# Altium project DIOT_Kasli_Adapter.PrjPCB (part 3 of 4)

## Sheet Clock_Distribution.SchDoc: DIOT_Kasli_Adapter
size 420 x 297 mm; CheckedBy: -; DrawnBy: Marcin Kiepiela; Address1: Warsaw University of Technology; Address2: Nowowiejska 15/19 00-665 Warsaw; DocumentNumber: 2; SheetNumber: 2; SheetTotal: 8; EDA_Number: ARTIQ; Projet: ARTIQ/Sinara/DIOT; ModifiedBy: -; CheckedDate: -; Title2: -; DivGrp: ISE; Designer: Marcin Kiepiela; ModifiedDate: -; ProjectName: DIOT_Kasli_Adapter.PrjPCB
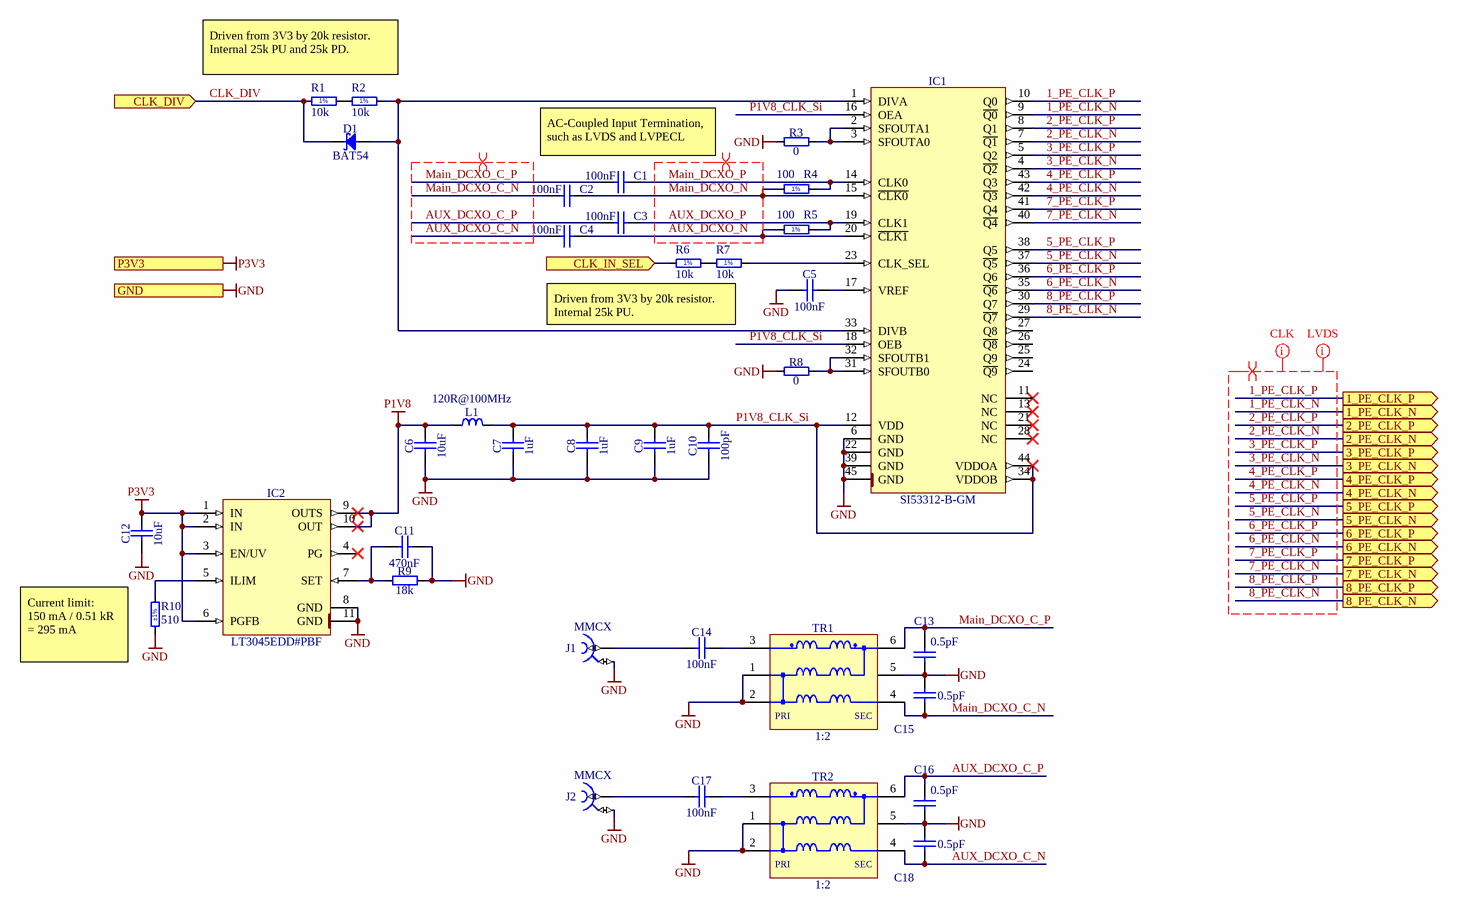
[diagram p4: Clock_Distribution.SchDoc]

### Parts
C1  100nF  [CAPC0603X33N]
C2  100nF  [CAPC0603X33N]
C3  100nF  [CAPC0603X33N]
C4  100nF  [CAPC0603X33N]
C5  100nF  [CAPC1005X55N]
C6  10uF  [CAPC1608X80N]
C7  1uF  [CAPC1608X87N]
C8  1uF  [CAPC1608X87N]
C9  1uF  [CAPC1608X87N]
C10  100pF  [CAPC1005X55N]
C11  470nF  [CAPC1005X55N]
C12  10uF  [CAPC1608X80N]
C13  0.5pF  [CAPC1005X50N]
C14  100nF  [CAPC1005X55N]
C15  0.5pF  [CAPC1005X50N]
C16  0.5pF  [CAPC1005X50N]
C17  100nF  [CAPC1005X55N]
C18  0.5pF  [CAPC1005X50N]
D1  BAT54  [SOT95P240X130-3N]
IC1  SI53312-B-GM  [QFN50P700X700X90-45N-S295]
IC2  LT3045EDD#PBF  [SON50P300X300X80-11N-R175X248]
J1  Family: MMCX  [HUBER-SUHNER_85_MMCX-50-0-1/111_OE]  (hidden comment: Coax_1Female_1Shield)
J2  Family: MMCX  [HUBER-SUHNER_85_MMCX-50-0-1/111_OE]  (hidden comment: Coax_1Female_1Shield)
L1  120R@100MHz  [INDC1608X95N]
R1  10k  [RESC1005X40N]
R2  10k  [RESC1005X40N]
R3  0  [RESC0603X28N]
R4  100  [RESC1005X40N]
R5  100  [RESC1005X40N]
R6  10k  [RESC1005X40N]
R7  10k  [RESC1005X40N]
R8  0  [RESC0603X28N]
R9  18k  [RESC1005X40N]
R10  510  Tolerance: ±1%  [RESC1005X40N]
TR1  1:2  [XFMR_MINI-CIRCUITS_DB1627]
TR2  1:2  [XFMR_MINI-CIRCUITS_DB1627]

### Ports
1_PE_CLK_N (out), 1_PE_CLK_P (out), 2_PE_CLK_N (out), 2_PE_CLK_P (out), 3_PE_CLK_N (out), 3_PE_CLK_P (out), 4_PE_CLK_N (out), 4_PE_CLK_P (out), 5_PE_CLK_N (out), 5_PE_CLK_P (out), 6_PE_CLK_N (out), 6_PE_CLK_P (out), 7_PE_CLK_N (out), 7_PE_CLK_P (out), 8_PE_CLK_N (out), 8_PE_CLK_P (out), CLK_DIV (in), CLK_IN_SEL (in), GND, P3V3 (in)

### Nets
GND: C5.1 C6.1 C7.1 C8.1 C9.1 C10.1 C11.2 C12.1 C13.1 C15.2 C16.1 C18.2 IC1.6(GND) IC1.22(GND) IC1.39(GND) IC1.45(GND) IC2.8(GND) IC2.11(GND) J1.2 J2.2 R3.1 R8.1 R9.2 R10.1 TR1.1(P1) TR1.2(P1) TR1.5(NC) TR2.1(P1) TR2.2(P1) TR2.5(NC) ; port GND
P1V8: C6.2 IC2.9(OUTS) IC2.10(OUT) L1.2
P3V3: C12.2 IC2.1(IN) IC2.2(IN) IC2.3(EN/UV) IC2.6(PGFB) ; port P3V3
1_PE_CLK_N: IC1.9(~{Q0}) ; port 1_PE_CLK_N
1_PE_CLK_P: IC1.10(Q0) ; port 1_PE_CLK_P
2_PE_CLK_N: IC1.7(~{Q1}) ; port 2_PE_CLK_N
2_PE_CLK_P: IC1.8(Q1) ; port 2_PE_CLK_P
3_PE_CLK_N: IC1.4(~{Q2}) ; port 3_PE_CLK_N
3_PE_CLK_P: IC1.5(Q2) ; port 3_PE_CLK_P
4_PE_CLK_N: IC1.42(~{Q3}) ; port 4_PE_CLK_N
4_PE_CLK_P: IC1.43(Q3) ; port 4_PE_CLK_P
5_PE_CLK_N: IC1.37(~{Q5}) ; port 5_PE_CLK_N
5_PE_CLK_P: IC1.38(Q5) ; port 5_PE_CLK_P
6_PE_CLK_N: IC1.35(~{Q6}) ; port 6_PE_CLK_N
6_PE_CLK_P: IC1.36(Q6) ; port 6_PE_CLK_P
7_PE_CLK_N: IC1.40(~{Q4}) ; port 7_PE_CLK_N
7_PE_CLK_P: IC1.41(Q4) ; port 7_PE_CLK_P
8_PE_CLK_N: IC1.29(~{Q7}) ; port 8_PE_CLK_N
8_PE_CLK_P: IC1.30(Q7) ; port 8_PE_CLK_P
AUX_DCXO_C_N: C4.1 C18.1 TR2.4(S1)  [project net AUX_DCXO_C_N_2]
AUX_DCXO_C_P: C3.1 C16.2 TR2.6(S1)  [project net AUX_DCXO_C_P_2]
AUX_DCXO_N: C4.2 IC1.20(~{CLK1}) R5.1  [project net AUX_DCXO_N_2]
AUX_DCXO_P: C3.2 IC1.19(CLK1) R5.2  [project net AUX_DCXO_P_2]
CLK_DIV: D1.3(C) R1.1 ; port CLK_DIV
CLK_IN_SEL: R6.1 ; port CLK_IN_SEL
Main_DCXO_C_N: C2.1 C15.1 TR1.4(S1)  [project net Main_DCXO_C_N_2]
Main_DCXO_C_P: C1.1 C13.2 TR1.6(S1)  [project net Main_DCXO_C_P_2]
Main_DCXO_N: C2.2 IC1.15(~{CLK0}) R4.1  [project net Main_DCXO_N_2]
Main_DCXO_P: C1.2 IC1.14(CLK0) R4.2  [project net Main_DCXO_P_2]
P1V8_CLK_Si: C7.2 C8.2 C9.2 C10.2 IC1.12(VDD) IC1.16(OEA) IC1.18(OEB) IC1.34(VDDOB) IC1.44(VDDOA) L1.1  [project net P1V8_CLK_Si_2]
NetC5_2: C5.2 IC1.17(VREF)
NetC11_1: C11.1 IC2.7(SET) R9.1
NetC14_1: C14.1 J1.1
NetC14_2: C14.2 TR1.3(P1)
NetC17_1: C17.1 J2.1
NetC17_2: C17.2 TR2.3(P1)
NetD1_1: D1.1(A) IC1.1(DIVA) IC1.33(DIVB) R2.2
NetIC1_2: IC1.2(SFOUTA1) IC1.3(SFOUTA0) R3.2
NetIC1_23: IC1.23(CLK_SEL) R7.2
NetIC1_31: IC1.31(SFOUTB0) IC1.32(SFOUTB1) R8.2
NetIC2_5: IC2.5(ILIM) R10.2
NetR1_2: R1.2 R2.1
NetR6_2: R6.2 R7.1

Not connected (* = marked no-connect by the designer): IC1 11(NC)* 13(NC)* 21(NC)* 24(~{Q9}) 25(Q9) 26(~{Q8}) 27(Q8) 28(NC)*; IC2 4(PG)*

### Layout directives
net class LVDS: 1_PE_CLK_N, 1_PE_CLK_P, 2_PE_CLK_N, 2_PE_CLK_P, 3_PE_CLK_N, 3_PE_CLK_P, 4_PE_CLK_N, 4_PE_CLK_P, 5_PE_CLK_N, 5_PE_CLK_P, 6_PE_CLK_N, 6_PE_CLK_P, 7_PE_CLK_N, 7_PE_CLK_P, 8_PE_CLK_N, 8_PE_CLK_P
net class CLK: 1_PE_CLK_N, 1_PE_CLK_P, 2_PE_CLK_N, 2_PE_CLK_P, 3_PE_CLK_N, 3_PE_CLK_P, 4_PE_CLK_N, 4_PE_CLK_P, 5_PE_CLK_N, 5_PE_CLK_P, 6_PE_CLK_N, 6_PE_CLK_P, 7_PE_CLK_N, 7_PE_CLK_P, 8_PE_CLK_N, 8_PE_CLK_P
differential pair: 1_PE_CLK_N, 1_PE_CLK_P, 2_PE_CLK_N, 2_PE_CLK_P, 3_PE_CLK_N, 3_PE_CLK_P, 4_PE_CLK_N, 4_PE_CLK_P, 5_PE_CLK_N, 5_PE_CLK_P, 6_PE_CLK_N, 6_PE_CLK_P, 7_PE_CLK_N, 7_PE_CLK_P, 8_PE_CLK_N, 8_PE_CLK_P, AUX_DCXO_C_N, AUX_DCXO_C_P, AUX_DCXO_N, AUX_DCXO_P, Main_DCXO_C_N, Main_DCXO_C_P, Main_DCXO_N, Main_DCXO_P

### Notes on the sheet
- Driven from 3V3 by 20k resistor.
  Internal 25k PU and 25k PD.
- AC-Coupled Input Termination, such as LVDS and LVPECL
- Driven from 3V3 by 20k resistor. Internal 25k PU.
- (near R10) Current limit:
  150 mA / 0.51 kR
  = 295 mA
- Project/Equipment
- Document
- Designer
- Drawn by
- Check.by
- Copyright WUT 2023.
  This document describes Open Hardware and is licensed under the CERN-OHL-W v2
  You may redistribute and modify this documentation and make products using it under the terms of the CERN-OHL-W v2 (https:/cern.ch/cern-ohl). This documentation is distributed WITHOUT ANY EXPRESS OR IMPLIED WARRANTY, INCLUDING OF MERCHANTABILITY, SATISFACTORY QUALITY AND FITNESS FOR A PARTICULAR PURPOSE. Please see the CERN-OHL-W v2 for applicable conditions.
  Source location: https://github.com/sinara-hw/EEM_FMC_Carrier
  As per CERN-OHL-W v2 section 4, should You produce hardware based on these sources, You must maintain the Source Location visible on the silkscreen or top copper for a EEM FMC Carrier PCB or other product you make using this documentation.
- Contact:
- File
- Last Mod.
- Print Date
- Sheet
- Size
- A3
- of
- Rev
- (in symbol R0402_10K_1%_0.0625W_100PPM) 1%
- (in symbol R0402_100R_1%_0.0625W_100PPM) 1%
- (in symbol XFMR_MINI-CIRCUITS_TCM2-43X+) PRI; SEC

### Library data of the parts
C1-C4 = CC0201_100NF_6.3V_10%_X5R: Non-polarised capacitor; Part Description: SMD Multilayer Chip Ceramic Capacitor; Manufacturer: GENERIC; Manufacturer1 Part Number: 02016D104KAT2A; Voltage: 6.3V; TC: X5R; Tolerance: ±10%; Part Number: CC0201_100NF_6.3V_10%_X5R; Component Kind: Standard; Component Type: Standard; Pin Count: 2; Value: 100nF; Status: Not Recommended; Manufacturer Part Number: CC0201_100NF_6.3V_10%_X5R; Case: 0201; Mounted: Yes; Socket: No; SMD: Yes; Sense: No; Manufacturer1 Example: AVX; Manufacturer1 ComponentHeight: 0.33mm; HelpURL: \\cern.ch\dfs\Applications\Altium\Datasheets\CC0201_X5R_AVX.pdf; Author: CERN DEM JLC; CreateDate: 03.12.2007; LatestRevisionDate: 03.12.2007
C5 C14 C17 = CC0402_100NF_16V_10%_X7R: Non-polarised capacitor; Part Description: SMD Multilayer Chip Ceramic Capacitor; Manufacturer: GENERIC; Manufacturer1 Part Number: GRM155R71C104KA88D; Voltage: 16V; TC: X7R; Tolerance: ±10%; Part Number: CC0402_100NF_16V_10%_X7R; Component Kind: Standard; Component Type: Standard; Pin Count: 2; Value: 100nF; Status: Not Recommended; Manufacturer Part Number: CC0402_100NF_16V_10%_X7R; Case: 0402; Mounted: Yes; Socket: No; SMD: Yes; Sense: No; Manufacturer1 Example: MURATA; Manufacturer1 ComponentHeight: 0.55mm; HelpURL: \\cern.ch\dfs\Applications\Altium\Datasheets\CC0402_X7R_MURATA_GRM.pdf; Author: CERN DEM JLC; CreateDate: 05.12.2013; LatestRevisionDate: 03.12.2007
C6 C12 = CC0603_10UF_10V_10%_X5R: Non-polarised capacitor; Part Description: SMD Multilayer Chip Ceramic Capacitor; Manufacturer: GENERIC; Manufacturer1 Part Number: GRM188R61A106KE69D; Voltage: 10V; TC: X5R; Tolerance: ±10%; Part Number: CC0603_10UF_10V_10%_X5R; Component Kind: Standard; Component Type: Standard; Pin Count: 2; Value: 10uF; Status: None; Manufacturer Part Number: CC0603_10UF_10V_10%_X5R; Case: 0603; Mounted: Yes; Socket: No; SMD: Yes; Sense: No; Manufacturer1 Example: MURATA; Manufacturer1 ComponentHeight: 0.8mm; HelpURL: \\cern.ch\dfs\Applications\Altium\Datasheets\CC0603_MURATA_GRM188R61A106KE69D.pdf; Author: CERN DEM JLC; CreateDate: 31.01.2017; LatestRevisionDate: 31.01.2017
C7-C9 = CC0603_1UF_25V_10%_X7R: Non-polarised capacitor; Part Description: SMD Multilayer Chip Ceramic Capacitor; Manufacturer: GENERIC; Manufacturer1 Part Number: GRM188R71E105KA12D; Voltage: 25V; TC: X7R; Tolerance: ±10%; Part Number: CC0603_1UF_25V_10%_X7R; Component Kind: Standard; Component Type: Standard; Pin Count: 2; Value: 1uF; Status: None; Manufacturer Part Number: CC0603_1UF_25V_10%_X7R; Case: 0603; Mounted: Yes; Socket: No; SMD: Yes; Sense: No; Manufacturer1 Example: MURATA; Manufacturer1 ComponentHeight: 0.9mm; HelpURL: \\cern.ch\dfs\Applications\Altium\Datasheets\CC0603_X7R_MURATA.pdf; Author: CERN DEM JLC; CreateDate: 18.01.2011; LatestRevisionDate: 18.01.2011
C10 = CC0402_100PF_50V_5%_C0G: Non-polarised capacitor; Part Description: SMD Multilayer Chip Ceramic Capacitor; Manufacturer: GENERIC; Manufacturer1 Part Number: C0402C101J5GACTU; Voltage: 50V; TC: C0G/NP0; Tolerance: ±5%; Part Number: CC0402_100PF_50V_5%_C0G; Component Kind: Standard; Component Type: Standard; Pin Count: 2; Value: 100pF; Status: Preferred; Manufacturer Part Number: CC0402_100PF_50V_5%_C0G; Case: 0402; Mounted: Yes; Socket: No; SMD: Yes; Sense: No; Manufacturer1 Example: KEMET; Manufacturer1 ComponentHeight: 0.55mm; HelpURL: \\cern.ch\dfs\Applications\Altium\Datasheets\CC0805_C0G_KEMET_(Commercial Grade).pdf; Author: CERN DEM JLC; CreateDate: 03.12.2007; LatestRevisionDate: 22.04.2015
C11 = CC0402_470NF_16V_10%_X5R: Non-polarised capacitor; Part Description: SMD Multilayer Chip Ceramic Capacitor; Manufacturer: GENERIC; Manufacturer1 Part Number: C1005X5R1C105KT; Voltage: 16V; TC: X5R; Tolerance: ±10%; Part Number: CC0402_470NF_16V_10%_X5R; Component Kind: Standard; Component Type: Standard; Pin Count: 2; Value: 470nF; Status: Preferred; Manufacturer Part Number: CC0402_470NF_16V_10%_X5R; Case: 0402; Mounted: Yes; Socket: No; SMD: Yes; Sense: No; Manufacturer1 Example: TDK; Manufacturer1 ComponentHeight: 0.55mm; HelpURL: \\cern.ch\dfs\Applications\Altium\Datasheets\CC0402_X5R_TDK_C.pdf; Author: CERN DEM JLC; CreateDate: 25.10.2012; LatestRevisionDate: 25.10.2012
C13 C15 C16 C18 = CC0402_0.5PF_25V_0.05PF_AVX_04023J0R5ABSTR: Non-polarised capacitor; Part Description: Thin-Film Chip Capacitors for RF Signal and Power Applications, Accu-P Series; Manufacturer: AVX; Voltage: 25V; Tolerance: ±0.05pF; Part Number: CC0402_0.5PF_25V_0.05PF_AVX_04023J0R5ABSTR; Component Kind: Standard; Component Type: Standard; Pin Count: 2; Value: 0.5pF; Status: None; Manufacturer Part Number: 04023J0R5ABSTR; Case: 0402; Mounted: Yes; Socket: No; SMD: Yes; Sense: No; ComponentHeight: 0.5mm; HelpURL: \\cern.ch\dfs\Applications\Altium\Datasheets\CC0402_AVX_ACCU-P.pdf; Author: CERN DEM JLC; CreateDate: 2017-02-22; LatestRevisionDate: 2017-02-22
D1 = BAT54: Diode Schottky  Anode Pin 1 Cathode Pin 3 (Pas de pin 2); Part Description: Single Small Signal Schottky Diode; Manufacturer: FAIRCHILD SEMICONDUCTOR; Voltage: 30V; Power: 200mA; PressFit: No; Bonding: No; Part Number: BAT54; Component Kind: Standard; Component Type: Standard; Device: BAT54; PackageDescription: SOT, 0.95mm Pitch; 3 Pin, 1.30mm W X 2.90mm L X 1.30mm H body, IPC Medium Density; Manufacturer Part Number: BAT54; Pin Count: 3; Case: SOT23-3; Mounted: Yes; Socket: No; SMD: Yes; Sense: No; ComponentHeight: 1.30mm; HelpURL: \\cern.ch\dfs\Applications\Altium\Datasheets\BAT54.pdf; Author: CERN DEM JLC; CreateDate: 17.09.2009; LatestRevisionDate: 27.05.2010
IC1 = SI53312-B-GM: 2 Input/10 Output, Low Jitter Universal Buffer/Level Translator With 2:1 Input Mux (<1.25 GHZ); Manufacturer: SILICON LABS; PressFit: No; Bonding: No; Part Number: SI53312-B-GM; Component Kind: Standard; Component Type: Standard; Device: SI53312-B-GM; PackageDescription: QFN, 0.50mm Pitch, Square; 44 Pin, 7.00mm L X 7.00mm W X 0.90mm H body (w/Thermal Tab 2.95 X 2.95mm), IPC Medium Density; Part Description: 2 Input/10 Output, Low Jitter Universal Buffer/Level Translator With 2:1 Input Mux (<1.25 GHZ); Manufacturer Part Number: SI53312-B-GM; Pin Count: 45; Case: QFN44; Mounted: Yes; Socket: No; SMD: Yes; Sense: No; ComponentHeight: 0.9mm; Author: CERN DEM MR; HelpURL: \\cern.ch\dfs\Applications\Altium\Datasheets\SI53312-B-GM.pdf; CreateDate: 02.10.2017; LatestRevisionDate: 02.10.2017
IC2 = LT3045EDD#PBF: 20V, 500mA, Ultralow Noise, Ultrahigh PSRR Linear Regulator; Manufacturer: LINEAR TECHNOLOGY; PressFit: No; Bonding: No; Part Number: LT3045EDD#PBF; Component Kind: Standard; Component Type: Standard; Device: LT3045EDD#PBF; PackageDescription: SON, 0.50mm Pitch; 10-pin, 3.00mm W  X 3.00mm L X 0.80mm H Body, (w/thermal tab 1.75 X 2.48 mm), IPC Medium Density; Part Description: 20V, 500mA, Ultralow Noise, Ultrahigh PSRR Linear Regulator; Manufacturer Part Number: LT3045EDD#PBF; Pin Count: 11; Case: SON10; Mounted: Yes; Socket: No; SMD: Yes; Sense: No; ComponentHeight: 0.8mm; HelpURL: \\cern.ch\dfs\Applications\Altium\Datasheets\LT3045EDD#PBF.pdf; Author: CERN DEM JLC; CreateDate: 07.12.2016; LatestRevisionDate: 07.12.2016
J1 J2 = HUBER-SUHNER_85_MMCX-50-0-1/111_OE: Part Description: MMCX 50 Ohms Right Angle PCB Jack; Manufacturer: HUBER+SUHNER; PressFit: No; Part Number: HUBER-SUHNER_85_MMCX-50-0-1/111_OE; Component Kind: Standard; Component Type: Standard; Pin Count: 2; Mounted: Yes; Socket: No; SMD: No; Sense: No; Status: None; Manufacturer Part Number: 85_MMCX-50-0-1/111_OE; ComponentHeight: 9.6mm; HelpURL: \\cern.ch\dfs\Applications\Altium\Datasheets\HUBER-SUHNER_85_MMCX-50-0-1-111_OE.pdf; Author: CERN DEM JLC; CreateDate: 06.11.2014; LatestRevisionDate: 06.11.2014
L1 = IND0603_MURATA_BLM18PG121SN1D: Inductor; Part Description: SMD EMIFIL Chip Ferrite Bead; Manufacturer: MURATA; Power: 2A; Resistance: 0.05R; Part Number: IND0603_MURATA_BLM18PG121SN1D; Component Kind: Standard; Component Type: Standard; Pin Count: 2; Value: 120R@100MHz; Status: None; Manufacturer Part Number: BLM18PG121SN1D; Case: 0603; Mounted: Yes; Socket: No; SMD: Yes; Sense: No; ComponentHeight: 0.95mm; HelpURL: \\cern.ch\dfs\Applications\Altium\Datasheets\IND0603_MURATA_BLM18P.pdf; Author: CERN DEM BC; CreateDate: 2015-07-27; LatestRevisionDate: 2015-07-27
R1 R2 R6 R7 = R0402_10K_1%_0.0625W_100PPM: Resistor - 1%; Part Description: General Purpose Thick Film Chip Resistor; Manufacturer: GENERIC; Manufacturer1 Part Number: 232270671003L; TC: ±100ppm/°C; Part Number: R0402_10K_1%_0.0625W_100PPM; Component Kind: Standard; Component Type: Standard; Pin Count: 2; Value: 10k; Status: Not recommended; Power: 0.0625W; Tolerance: ±1%; Manufacturer Part Number: R0402_10K_1%_0.0625W_100PPM; Case: 0402; Mounted: Yes; Sense: No; Socket: No; SMD: Yes; Manufacturer1 Example: YAGEO PHYCOMP; Manufacturer1 ComponentHeight: 0.4mm; HelpURL: \\cern.ch\dfs\Applications\Altium\Datasheets\R0402_Phycomp_RC0402.pdf; Author: CERN DEM JLC; CreateDate: 03.12.2007; LatestRevisionDate: 17.10.2012
R3 R8 = R0201_0R_JUMPER: Resistor; Part Description: 1A (0.05R Max DC Resistance) Zero Ohm Jumper; Manufacturer: GENERIC; Manufacturer1 Part Number: CRCW02010000Z0ED; PressFit: No; Part Number: R0201_0R_JUMPER; Component Kind: Standard; Component Type: Standard; Pin Count: 2; Value: 0; Status: Not Recommended; Manufacturer Part Number: R0201_0R_JUMPER; Case: 0201; Mounted: Yes; Sense: No; Socket: No; SMD: Yes; Manufacturer1 Example: VISHAY; Manufacturer1 ComponentHeight: 0.27mm; HelpURL: \\cern.ch\dfs\Applications\Altium\Datasheets\R0201_VISHAY_CRCW e3.pdf; Author: CERN DEM JLC; CreateDate: 19.11.2014; LatestRevisionDate: 08.01.2015
R4 R5 = R0402_100R_1%_0.0625W_100PPM: Resistor - 1%; Part Description: General Purpose Thick Film Chip Resistor; Manufacturer: GENERIC; Manufacturer1 Part Number: 232270671001L; TC: ±100ppm/°C; PressFit: No; Part Number: R0402_100R_1%_0.0625W_100PPM; Component Kind: Standard; Component Type: Standard; Pin Count: 2; Value: 100; Status: Not Recommended; Power: 0.0625W; Tolerance: ±1%; Manufacturer Part Number: R0402_100R_1%_0.0625W_100PPM; Case: 0402; Mounted: Yes; Sense: No; Socket: No; SMD: Yes; Manufacturer1 Example: YAGEO PHYCOMP; Manufacturer1 ComponentHeight: 0.4mm; HelpURL: \\cern.ch\dfs\Applications\Altium\Datasheets\R0402_Phycomp_RC0402.pdf; Author: CERN DEM JLC; CreateDate: 03.12.2007; LatestRevisionDate: 17.10.2012
R9 = R0402_18K_1%_0.0625W_100PPM: Resistor - 1%; Part Description: General Purpose Thick Film Chip Resistor; Manufacturer: GENERIC; Manufacturer1 Part Number: 232270671803L; TC: ±100ppm/°C; PressFit: No; Part Number: R0402_18K_1%_0.0625W_100PPM; Component Kind: Standard; Component Type: Standard; Pin Count: 2; Value: 18k; Status: Not Recommended; Power: 0.0625W; Tolerance: ±1%; Manufacturer Part Number: R0402_18K_1%_0.0625W_100PPM; Case: 0402; Mounted: Yes; Sense: No; Socket: No; SMD: Yes; Manufacturer1 Example: YAGEO PHYCOMP; Manufacturer1 ComponentHeight: 0.4mm; HelpURL: \\cern.ch\dfs\Applications\Altium\Datasheets\R0402_Phycomp_RC0402.pdf; Author: CERN DEM JLC; CreateDate: 03.12.2007; LatestRevisionDate: 17.10.2012
R10 = R0402_510R_1%_0.0625W_100PPM: Resistor - 1%; Part Description: General Purpose Thick Film Chip Resistor; Manufacturer: GENERIC; Manufacturer1 Part Number: 232270675101L; TC: ±100ppm/°C; PressFit: No; Part Number: R0402_510R_1%_0.0625W_100PPM; Component Kind: Standard; Component Type: Standard; Pin Count: 2; Value: 510; Status: Not Recommended; Power: 0.0625W; Manufacturer Part Number: R0402_510R_1%_0.0625W_100PPM; Case: 0402; Mounted: Yes; Sense: No; Socket: No; SMD: Yes; Manufacturer1 Example: YAGEO PHYCOMP; Manufacturer1 ComponentHeight: 0.4mm; HelpURL: \\cern.ch\dfs\Applications\Altium\Datasheets\R0402_Phycomp_RC0402.pdf; Author: CERN DEM JLC; CreateDate: 03.12.2007; LatestRevisionDate: 17.10.2012
TR1 TR2 = XFMR_MINI-CIRCUITS_TCM2-43X+: 50 OHMS 10 to 4000 MHz RF Transformer; Power: 0.4W; Part Number: XFMR_MINI-CIRCUITS_TCM2-43X+; Component Kind: Standard; Component Type: Standard; Pin Count: 6; Value: 1:2; Status: None; Part Description: 50 Ohms 10 to 4000MHz RF Transformer; Manufacturer: MINI-CIRCUITS; Manufacturer Part Number: TCM2-43X+; Mounted: Yes; Socket: No; Sense: No; SMD: Yes; ComponentHeight: 4.06mm; HelpURL: \\cern.ch\dfs\Applications\Altium\Datasheets\XFMR_MINI-CIRCUITS_TCM2-43X+.pdf; Author: CERN DEM BC; CreateDate: 2016-02-12; LatestRevisionDate: 2016-02-12

## Sheet IDC_EXT_CPCIS_interconn_map.SchDoc: DIOT_Kasli_Adapter
size 420 x 297 mm; CheckedBy: -; DrawnBy: Marcin Kiepiela; Address1: Warsaw University of Technology; Address2: Nowowiejska 15/19 00-665 Warsaw; DocumentNumber: 6; SheetNumber: 6; SheetTotal: 8; EDA_Number: ARTIQ; Projet: ARTIQ/Sinara/DIOT; ModifiedBy: -; CheckedDate: -; Title2: -; DivGrp: ISE; Designer: Marcin Kiepiela; ModifiedDate: -; ProjectName: DIOT_Kasli_Adapter.PrjPCB
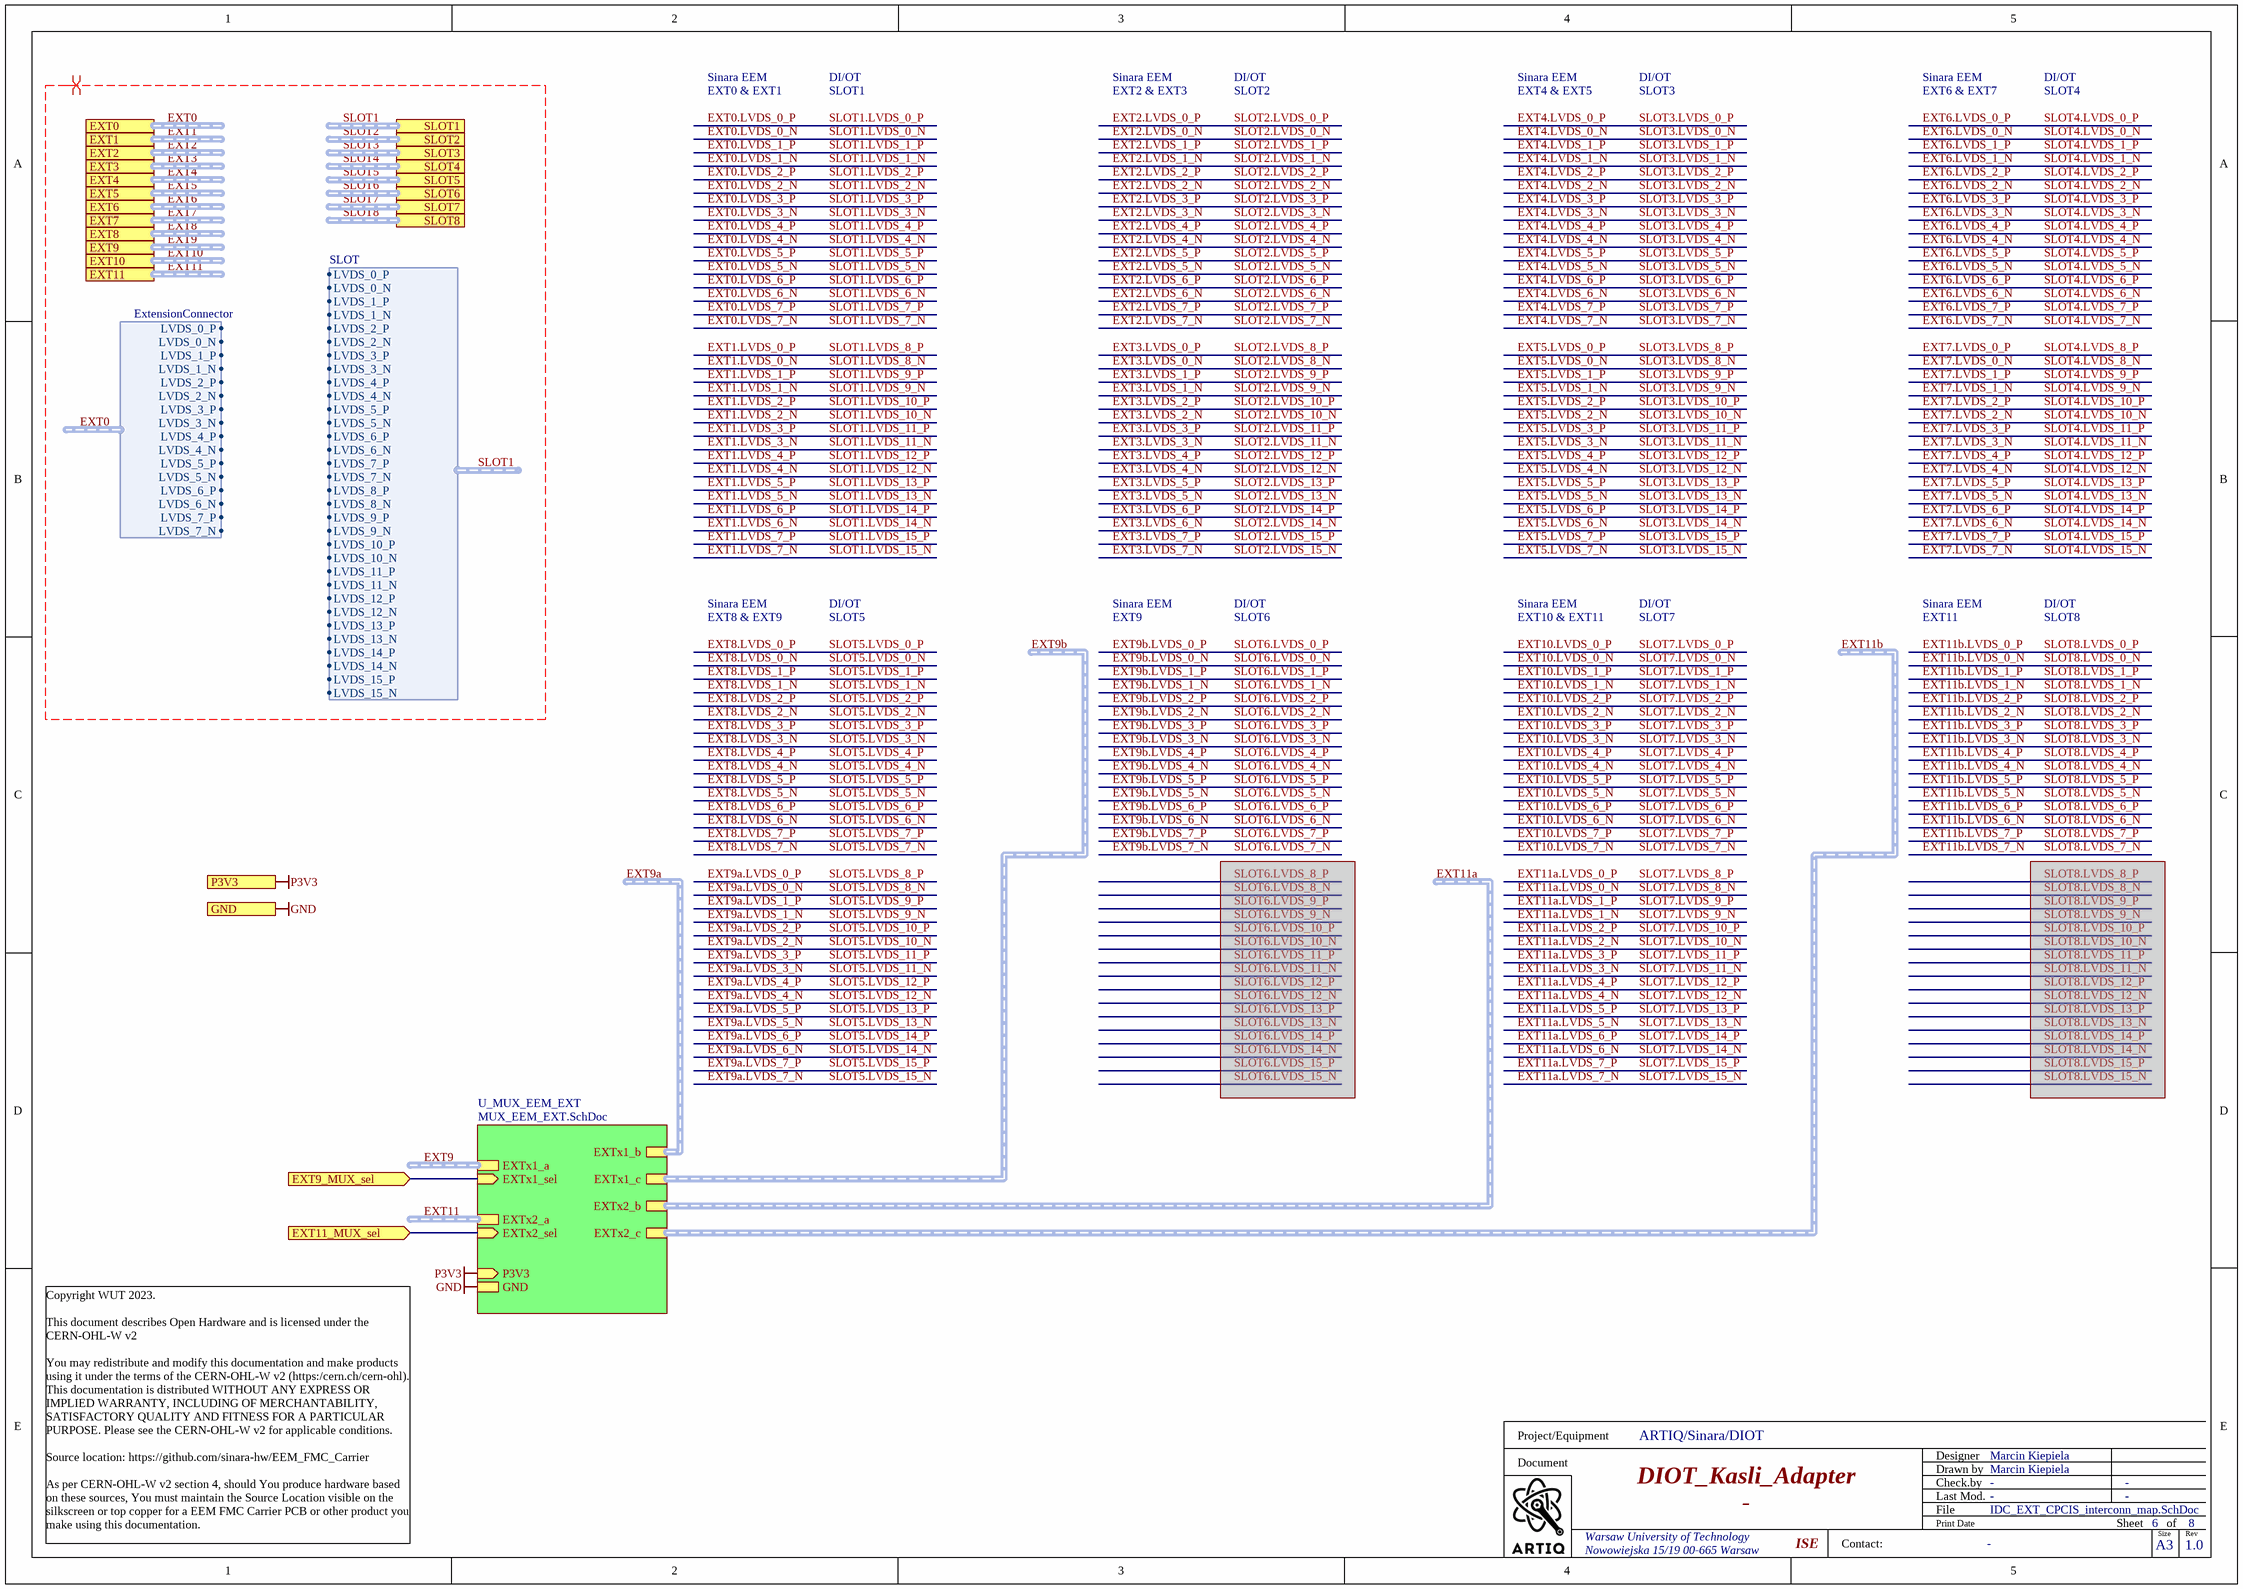
[diagram p5: IDC_EXT_CPCIS_interconn_map.SchDoc]

### Sub-sheets
U_MUX_EEM_EXT = MUX_EEM_EXT.SchDoc: EXTx1_a (harness ExtensionConnector), EXTx1_b (harness ExtensionConnector), EXTx1_c (harness ExtensionConnector), EXTx2_a (harness ExtensionConnector), EXTx2_b (harness ExtensionConnector), EXTx2_c (harness ExtensionConnector), GND, P3V3 (in), EXTx1_sel (in), EXTx2_sel (in)

### Ports
EXT0 (harness ExtensionConnector), EXT1 (harness ExtensionConnector), EXT2 (harness ExtensionConnector), EXT3 (harness ExtensionConnector), EXT4 (harness ExtensionConnector), EXT5 (harness ExtensionConnector), EXT6 (harness ExtensionConnector), EXT7 (harness ExtensionConnector), EXT8 (harness ExtensionConnector), EXT9 (harness ExtensionConnector), EXT9_MUX_sel (in), EXT10 (harness ExtensionConnector), EXT11 (harness ExtensionConnector), EXT11_MUX_sel (in), GND, P3V3 (in), SLOT1 (harness SLOT), SLOT2 (harness SLOT), SLOT3 (harness SLOT), SLOT4 (harness SLOT), SLOT5 (harness SLOT), SLOT6 (harness ExtensionConnector), SLOT7 (harness SLOT), SLOT8 (harness ExtensionConnector)

### Harnesses
ExtensionConnector: LVDS_0_N, LVDS_0_P, LVDS_1_N, LVDS_1_P, LVDS_2_N, LVDS_2_P, LVDS_3_N, LVDS_3_P, LVDS_4_N, LVDS_4_P, LVDS_5_N, LVDS_5_P, LVDS_6_N, LVDS_6_P, LVDS_7_N, LVDS_7_P
SLOT: LVDS_0_P, LVDS_0_N, LVDS_1_P, LVDS_1_N, LVDS_2_P, LVDS_2_N, LVDS_3_P, LVDS_3_N, LVDS_4_P, LVDS_4_N, LVDS_5_P, LVDS_5_N, LVDS_6_P, LVDS_6_N, LVDS_7_P, LVDS_7_N, LVDS_8_P, LVDS_8_N, LVDS_9_P, LVDS_9_N, LVDS_10_P, LVDS_10_N, LVDS_11_P, LVDS_11_N, LVDS_12_P, LVDS_12_N, LVDS_13_P, LVDS_13_N, LVDS_14_P, LVDS_14_N, LVDS_15_P, LVDS_15_N

### Nets
GND: port GND, sheet U_MUX_EEM_EXT/GND
P3V3: port P3V3, sheet U_MUX_EEM_EXT/P3V3
EXT9_MUX_sel: port EXT9_MUX_sel, sheet U_MUX_EEM_EXT/EXTx1_sel
EXT11_MUX_sel: port EXT11_MUX_sel, sheet U_MUX_EEM_EXT/EXTx2_sel

### Buses and harness runs
harness EXT0 = port EXT0
harness EXT1 = port EXT1
harness EXT2 = port EXT2
harness EXT3 = port EXT3
harness EXT4 = port EXT4
harness EXT5 = port EXT5
harness EXT6 = port EXT6
harness EXT7 = port EXT7
harness EXT8 = port EXT8
harness EXT9 = port EXT9
harness EXT9 = sheet U_MUX_EEM_EXT/EXTx1_a
harness EXT9a = sheet U_MUX_EEM_EXT/EXTx1_b
harness EXT9b = sheet U_MUX_EEM_EXT/EXTx1_c
harness EXT10 = port EXT10
harness EXT11 = port EXT11
harness EXT11 = sheet U_MUX_EEM_EXT/EXTx2_a
harness EXT11a = sheet U_MUX_EEM_EXT/EXTx2_b
harness EXT11b = sheet U_MUX_EEM_EXT/EXTx2_c
harness SLOT1 = port SLOT1
harness SLOT2 = port SLOT2
harness SLOT3 = port SLOT3
harness SLOT4 = port SLOT4
harness SLOT5 = port SLOT5
harness SLOT6 = port SLOT6
harness SLOT7 = port SLOT7
harness SLOT8 = port SLOT8

### Layout directives
differential pair: EXT0, EXT1, EXT2, EXT3, EXT4, EXT5, EXT6, EXT7, EXT8, EXT9, EXT10, EXT11, SLOT1, SLOT2, SLOT3, SLOT4, SLOT5, SLOT6, SLOT7, SLOT8

### Notes on the sheet
- EXT0 & EXT1
- Sinara EEM
- SLOT1
- DI/OT
- EXT2 & EXT3
- SLOT2
- EXT4 & EXT5
- SLOT3
- EXT6 & EXT7
- SLOT4
- EXT8 & EXT9
- SLOT5
- EXT9
- SLOT6
- EXT10 & EXT11
- SLOT7
- EXT11
- SLOT8
- Project/Equipment
- Document
- Designer
- Drawn by
- Check.by
- Copyright WUT 2023.
  This document describes Open Hardware and is licensed under the CERN-OHL-W v2
  You may redistribute and modify this documentation and make products using it under the terms of the CERN-OHL-W v2 (https:/cern.ch/cern-ohl). This documentation is distributed WITHOUT ANY EXPRESS OR IMPLIED WARRANTY, INCLUDING OF MERCHANTABILITY, SATISFACTORY QUALITY AND FITNESS FOR A PARTICULAR PURPOSE. Please see the CERN-OHL-W v2 for applicable conditions.
  Source location: https://github.com/sinara-hw/EEM_FMC_Carrier
  As per CERN-OHL-W v2 section 4, should You produce hardware based on these sources, You must maintain the Source Location visible on the silkscreen or top copper for a EEM FMC Carrier PCB or other product you make using this documentation.
- Contact:
- File
- Last Mod.
- Print Date
- Sheet
- Size
- A3
- of
- Rev

## Sheet MUX_EEM_EXT.SchDoc: DIOT_Kasli_Adapter
size 420 x 297 mm; CheckedBy: -; DrawnBy: Marcin Kiepiela; Address1: Warsaw University of Technology; Address2: Nowowiejska 15/19 00-665 Warsaw; DocumentNumber: 7; SheetNumber: 7; SheetTotal: 8; EDA_Number: ARTIQ; Projet: ARTIQ/Sinara/DIOT; ModifiedBy: -; CheckedDate: -; Title2: -; DivGrp: ISE; Designer: Marcin Kiepiela; ModifiedDate: -; ProjectName: DIOT_Kasli_Adapter.PrjPCB
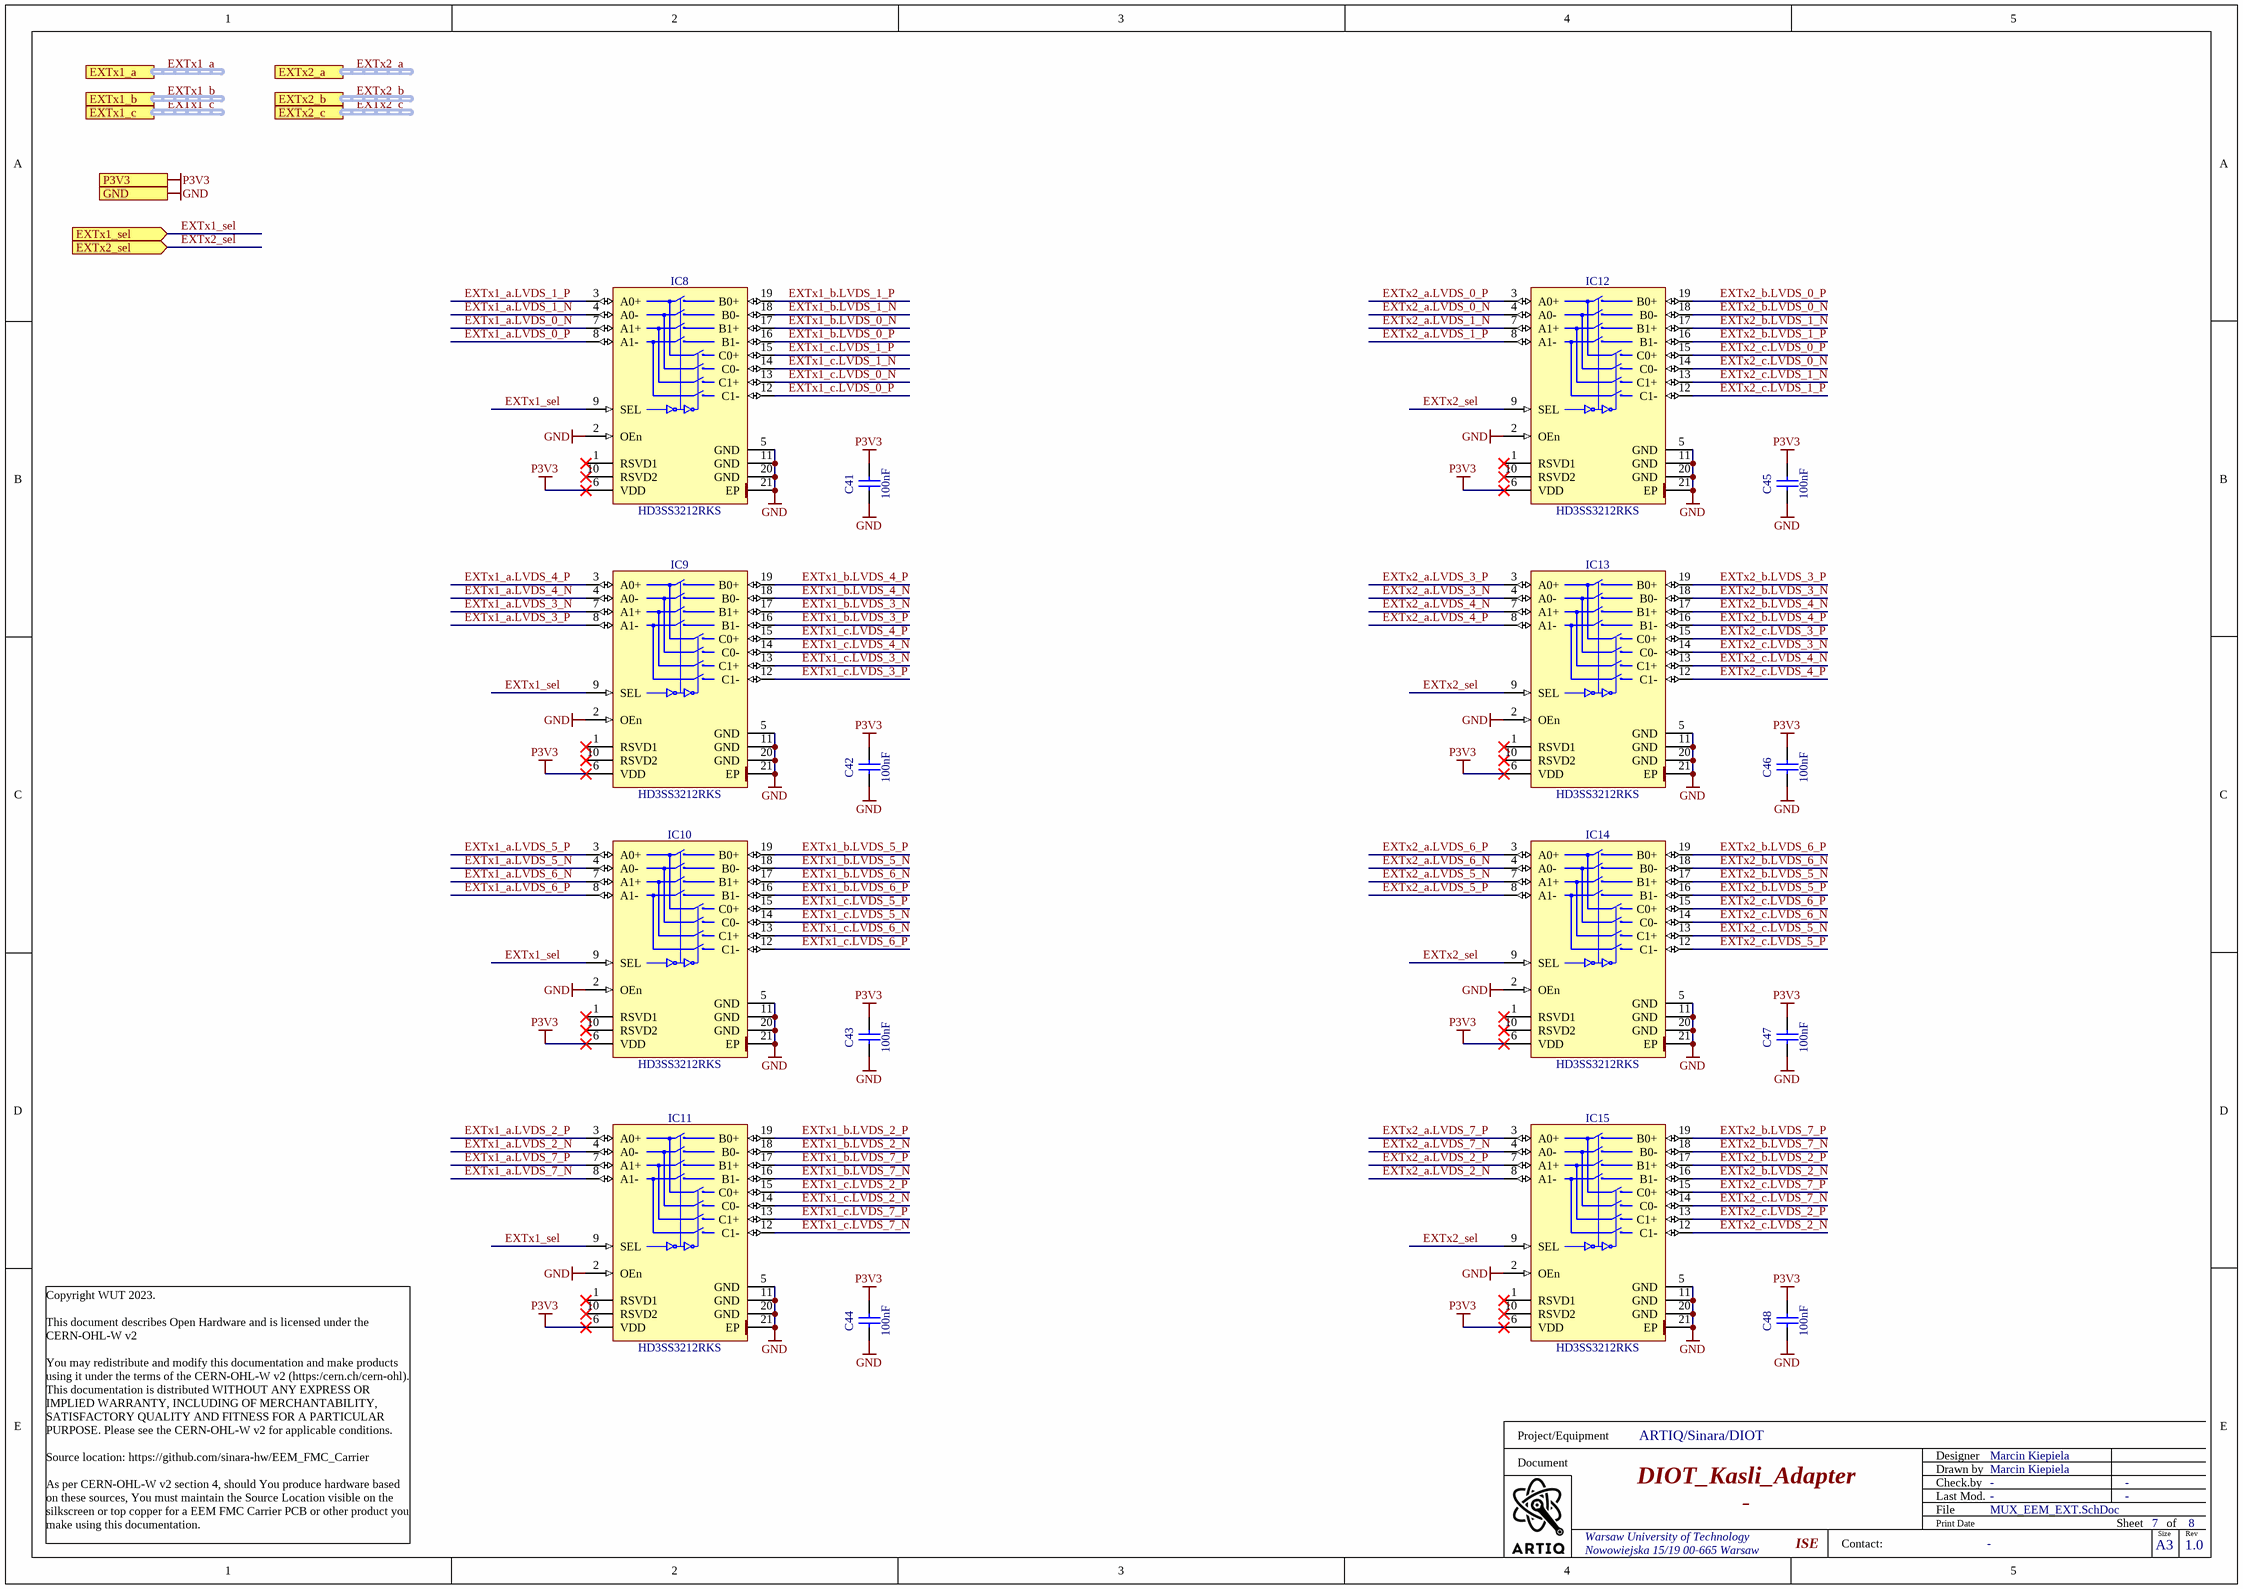
[diagram p6: MUX_EEM_EXT.SchDoc]

### Parts
C41  100nF  [CAPC1005X55N]
C42  100nF  [CAPC1005X55N]
C43  100nF  [CAPC1005X55N]
C44  100nF  [CAPC1005X55N]
C45  100nF  [CAPC1005X55N]
C46  100nF  [CAPC1005X55N]
C47  100nF  [CAPC1005X55N]
C48  100nF  [CAPC1005X55N]
IC8  HD3SS3212RKS  [TEXAS_RKS0020A]
IC9  HD3SS3212RKS  [TEXAS_RKS0020A]
IC10  HD3SS3212RKS  [TEXAS_RKS0020A]
IC11  HD3SS3212RKS  [TEXAS_RKS0020A]
IC12  HD3SS3212RKS  [TEXAS_RKS0020A]
IC13  HD3SS3212RKS  [TEXAS_RKS0020A]
IC14  HD3SS3212RKS  [TEXAS_RKS0020A]
IC15  HD3SS3212RKS  [TEXAS_RKS0020A]

### Ports
EXTx1_a (harness ExtensionConnector), EXTx1_b (harness ExtensionConnector), EXTx1_c (harness ExtensionConnector), EXTx1_sel (in), EXTx2_a (harness ExtensionConnector), EXTx2_b (harness ExtensionConnector), EXTx2_c (harness ExtensionConnector), EXTx2_sel (in), GND, P3V3 (in)

### Nets
GND: C41.1 C42.1 C43.1 C44.1 C45.1 C46.1 C47.1 C48.1 IC8.2(OEn) IC8.5(GND) IC8.11(GND) IC8.20(GND) IC8.21(EP) IC9.2(OEn) IC9.5(GND) IC9.11(GND) IC9.20(GND) IC9.21(EP) IC10.2(OEn) IC10.5(GND) IC10.11(GND) IC10.20(GND) IC10.21(EP) IC11.2(OEn) IC11.5(GND) IC11.11(GND) IC11.20(GND) IC11.21(EP) IC12.2(OEn) IC12.5(GND) IC12.11(GND) IC12.20(GND) IC12.21(EP) IC13.2(OEn) IC13.5(GND) IC13.11(GND) IC13.20(GND) IC13.21(EP) IC14.2(OEn) IC14.5(GND) IC14.11(GND) IC14.20(GND) IC14.21(EP) IC15.2(OEn) IC15.5(GND) IC15.11(GND) IC15.20(GND) IC15.21(EP) ; port GND
P3V3: C41.2 C42.2 C43.2 C44.2 C45.2 C46.2 C47.2 C48.2 IC8.6(VDD) IC9.6(VDD) IC10.6(VDD) IC11.6(VDD) IC12.6(VDD) IC13.6(VDD) IC14.6(VDD) IC15.6(VDD) ; port P3V3
EXTx1_a.LVDS_0_N: IC8.7(A1+)  [project net EXTx1_a.LVDS_0_N_7]
EXTx1_a.LVDS_0_P: IC8.8(A1-)  [project net EXTx1_a.LVDS_0_P_7]
EXTx1_a.LVDS_1_N: IC8.4(A0-)  [project net EXTx1_a.LVDS_1_N_7]
EXTx1_a.LVDS_1_P: IC8.3(A0+)  [project net EXTx1_a.LVDS_1_P_7]
EXTx1_a.LVDS_2_N: IC11.4(A0-)  [project net EXTx1_a.LVDS_2_N_7]
EXTx1_a.LVDS_2_P: IC11.3(A0+)  [project net EXTx1_a.LVDS_2_P_7]
EXTx1_a.LVDS_3_N: IC9.7(A1+)  [project net EXTx1_a.LVDS_3_N_7]
EXTx1_a.LVDS_3_P: IC9.8(A1-)  [project net EXTx1_a.LVDS_3_P_7]
EXTx1_a.LVDS_4_N: IC9.4(A0-)  [project net EXTx1_a.LVDS_4_N_7]
EXTx1_a.LVDS_4_P: IC9.3(A0+)  [project net EXTx1_a.LVDS_4_P_7]
EXTx1_a.LVDS_5_N: IC10.4(A0-)  [project net EXTx1_a.LVDS_5_N_7]
EXTx1_a.LVDS_5_P: IC10.3(A0+)  [project net EXTx1_a.LVDS_5_P_7]
EXTx1_a.LVDS_6_N: IC10.7(A1+)  [project net EXTx1_a.LVDS_6_N_7]
EXTx1_a.LVDS_6_P: IC10.8(A1-)  [project net EXTx1_a.LVDS_6_P_7]
EXTx1_a.LVDS_7_N: IC11.8(A1-)  [project net EXTx1_a.LVDS_7_N_7]
EXTx1_a.LVDS_7_P: IC11.7(A1+)  [project net EXTx1_a.LVDS_7_P_7]
EXTx1_b.LVDS_0_N: IC8.17(B1+)  [project net EXTx1_b.LVDS_0_N_7]
EXTx1_b.LVDS_0_P: IC8.16(B1-)  [project net EXTx1_b.LVDS_0_P_7]
EXTx1_b.LVDS_1_N: IC8.18(B0-)  [project net EXTx1_b.LVDS_1_N_7]
EXTx1_b.LVDS_1_P: IC8.19(B0+)  [project net EXTx1_b.LVDS_1_P_7]
EXTx1_b.LVDS_2_N: IC11.18(B0-)  [project net EXTx1_b.LVDS_2_N_7]
EXTx1_b.LVDS_2_P: IC11.19(B0+)  [project net EXTx1_b.LVDS_2_P_7]
EXTx1_b.LVDS_3_N: IC9.17(B1+)  [project net EXTx1_b.LVDS_3_N_7]
EXTx1_b.LVDS_3_P: IC9.16(B1-)  [project net EXTx1_b.LVDS_3_P_7]
EXTx1_b.LVDS_4_N: IC9.18(B0-)  [project net EXTx1_b.LVDS_4_N_7]
EXTx1_b.LVDS_4_P: IC9.19(B0+)  [project net EXTx1_b.LVDS_4_P_7]
EXTx1_b.LVDS_5_N: IC10.18(B0-)  [project net EXTx1_b.LVDS_5_N_7]
EXTx1_b.LVDS_5_P: IC10.19(B0+)  [project net EXTx1_b.LVDS_5_P_7]
EXTx1_b.LVDS_6_N: IC10.17(B1+)  [project net EXTx1_b.LVDS_6_N_7]
EXTx1_b.LVDS_6_P: IC10.16(B1-)  [project net EXTx1_b.LVDS_6_P_7]
EXTx1_b.LVDS_7_N: IC11.16(B1-)  [project net EXTx1_b.LVDS_7_N_7]
EXTx1_b.LVDS_7_P: IC11.17(B1+)  [project net EXTx1_b.LVDS_7_P_7]
EXTx1_c.LVDS_0_N: IC8.13(C1+)  [project net EXTx1_c.LVDS_0_N_7]
EXTx1_c.LVDS_0_P: IC8.12(C1-)  [project net EXTx1_c.LVDS_0_P_7]
EXTx1_c.LVDS_1_N: IC8.14(C0-)  [project net EXTx1_c.LVDS_1_N_7]
EXTx1_c.LVDS_1_P: IC8.15(C0+)  [project net EXTx1_c.LVDS_1_P_7]
EXTx1_c.LVDS_2_N: IC11.14(C0-)  [project net EXTx1_c.LVDS_2_N_7]
EXTx1_c.LVDS_2_P: IC11.15(C0+)  [project net EXTx1_c.LVDS_2_P_7]
EXTx1_c.LVDS_3_N: IC9.13(C1+)  [project net EXTx1_c.LVDS_3_N_7]
EXTx1_c.LVDS_3_P: IC9.12(C1-)  [project net EXTx1_c.LVDS_3_P_7]
EXTx1_c.LVDS_4_N: IC9.14(C0-)  [project net EXTx1_c.LVDS_4_N_7]
EXTx1_c.LVDS_4_P: IC9.15(C0+)  [project net EXTx1_c.LVDS_4_P_7]
EXTx1_c.LVDS_5_N: IC10.14(C0-)  [project net EXTx1_c.LVDS_5_N_7]
EXTx1_c.LVDS_5_P: IC10.15(C0+)  [project net EXTx1_c.LVDS_5_P_7]
EXTx1_c.LVDS_6_N: IC10.13(C1+)  [project net EXTx1_c.LVDS_6_N_7]
EXTx1_c.LVDS_6_P: IC10.12(C1-)  [project net EXTx1_c.LVDS_6_P_7]
EXTx1_c.LVDS_7_N: IC11.12(C1-)  [project net EXTx1_c.LVDS_7_N_7]
EXTx1_c.LVDS_7_P: IC11.13(C1+)  [project net EXTx1_c.LVDS_7_P_7]
EXTx1_sel: IC8.9(SEL) IC9.9(SEL) IC10.9(SEL) IC11.9(SEL) ; port EXTx1_sel  [project net EXT9_MUX_sel]
EXTx2_a.LVDS_0_N: IC12.4(A0-)  [project net EXTx2_a.LVDS_0_N_7]
EXTx2_a.LVDS_0_P: IC12.3(A0+)  [project net EXTx2_a.LVDS_0_P_7]
EXTx2_a.LVDS_1_N: IC12.7(A1+)  [project net EXTx2_a.LVDS_1_N_7]
EXTx2_a.LVDS_1_P: IC12.8(A1-)  [project net EXTx2_a.LVDS_1_P_7]
EXTx2_a.LVDS_2_N: IC15.8(A1-)  [project net EXTx2_a.LVDS_2_N_7]
EXTx2_a.LVDS_2_P: IC15.7(A1+)  [project net EXTx2_a.LVDS_2_P_7]
EXTx2_a.LVDS_3_N: IC13.4(A0-)  [project net EXTx2_a.LVDS_3_N_7]
EXTx2_a.LVDS_3_P: IC13.3(A0+)  [project net EXTx2_a.LVDS_3_P_7]
EXTx2_a.LVDS_4_N: IC13.7(A1+)  [project net EXTx2_a.LVDS_4_N_7]
EXTx2_a.LVDS_4_P: IC13.8(A1-)  [project net EXTx2_a.LVDS_4_P_7]
EXTx2_a.LVDS_5_N: IC14.7(A1+)  [project net EXTx2_a.LVDS_5_N_7]
EXTx2_a.LVDS_5_P: IC14.8(A1-)  [project net EXTx2_a.LVDS_5_P_7]
EXTx2_a.LVDS_6_N: IC14.4(A0-)  [project net EXTx2_a.LVDS_6_N_7]
EXTx2_a.LVDS_6_P: IC14.3(A0+)  [project net EXTx2_a.LVDS_6_P_7]
EXTx2_a.LVDS_7_N: IC15.4(A0-)  [project net EXTx2_a.LVDS_7_N_7]
EXTx2_a.LVDS_7_P: IC15.3(A0+)  [project net EXTx2_a.LVDS_7_P_7]
EXTx2_b.LVDS_0_N: IC12.18(B0-)  [project net EXTx2_b.LVDS_0_N_7]
EXTx2_b.LVDS_0_P: IC12.19(B0+)  [project net EXTx2_b.LVDS_0_P_7]
EXTx2_b.LVDS_1_N: IC12.17(B1+)  [project net EXTx2_b.LVDS_1_N_7]
EXTx2_b.LVDS_1_P: IC12.16(B1-)  [project net EXTx2_b.LVDS_1_P_7]
EXTx2_b.LVDS_2_N: IC15.16(B1-)  [project net EXTx2_b.LVDS_2_N_7]
EXTx2_b.LVDS_2_P: IC15.17(B1+)  [project net EXTx2_b.LVDS_2_P_7]
EXTx2_b.LVDS_3_N: IC13.18(B0-)  [project net EXTx2_b.LVDS_3_N_7]
EXTx2_b.LVDS_3_P: IC13.19(B0+)  [project net EXTx2_b.LVDS_3_P_7]
EXTx2_b.LVDS_4_N: IC13.17(B1+)  [project net EXTx2_b.LVDS_4_N_7]
EXTx2_b.LVDS_4_P: IC13.16(B1-)  [project net EXTx2_b.LVDS_4_P_7]
EXTx2_b.LVDS_5_N: IC14.17(B1+)  [project net EXTx2_b.LVDS_5_N_7]
EXTx2_b.LVDS_5_P: IC14.16(B1-)  [project net EXTx2_b.LVDS_5_P_7]
EXTx2_b.LVDS_6_N: IC14.18(B0-)  [project net EXTx2_b.LVDS_6_N_7]
EXTx2_b.LVDS_6_P: IC14.19(B0+)  [project net EXTx2_b.LVDS_6_P_7]
EXTx2_b.LVDS_7_N: IC15.18(B0-)  [project net EXTx2_b.LVDS_7_N_7]
EXTx2_b.LVDS_7_P: IC15.19(B0+)  [project net EXTx2_b.LVDS_7_P_7]
EXTx2_c.LVDS_0_N: IC12.14(C0-)  [project net EXTx2_c.LVDS_0_N_7]
EXTx2_c.LVDS_0_P: IC12.15(C0+)  [project net EXTx2_c.LVDS_0_P_7]
EXTx2_c.LVDS_1_N: IC12.13(C1+)  [project net EXTx2_c.LVDS_1_N_7]
EXTx2_c.LVDS_1_P: IC12.12(C1-)  [project net EXTx2_c.LVDS_1_P_7]
EXTx2_c.LVDS_2_N: IC15.12(C1-)  [project net EXTx2_c.LVDS_2_N_7]
EXTx2_c.LVDS_2_P: IC15.13(C1+)  [project net EXTx2_c.LVDS_2_P_7]
EXTx2_c.LVDS_3_N: IC13.14(C0-)  [project net EXTx2_c.LVDS_3_N_7]
EXTx2_c.LVDS_3_P: IC13.15(C0+)  [project net EXTx2_c.LVDS_3_P_7]
EXTx2_c.LVDS_4_N: IC13.13(C1+)  [project net EXTx2_c.LVDS_4_N_7]
EXTx2_c.LVDS_4_P: IC13.12(C1-)  [project net EXTx2_c.LVDS_4_P_7]
EXTx2_c.LVDS_5_N: IC14.13(C1+)  [project net EXTx2_c.LVDS_5_N_7]
EXTx2_c.LVDS_5_P: IC14.12(C1-)  [project net EXTx2_c.LVDS_5_P_7]
EXTx2_c.LVDS_6_N: IC14.14(C0-)  [project net EXTx2_c.LVDS_6_N_7]
EXTx2_c.LVDS_6_P: IC14.15(C0+)  [project net EXTx2_c.LVDS_6_P_7]
EXTx2_c.LVDS_7_N: IC15.14(C0-)  [project net EXTx2_c.LVDS_7_N_7]
EXTx2_c.LVDS_7_P: IC15.15(C0+)  [project net EXTx2_c.LVDS_7_P_7]
EXTx2_sel: IC12.9(SEL) IC13.9(SEL) IC14.9(SEL) IC15.9(SEL) ; port EXTx2_sel  [project net EXT11_MUX_sel]

Not connected (* = marked no-connect by the designer): IC8 1(RSVD1)* 10(RSVD2)*; IC9 1(RSVD1)* 10(RSVD2)*; IC10 1(RSVD1)* 10(RSVD2)*; IC11 1(RSVD1)* 10(RSVD2)*; IC12 1(RSVD1)* 10(RSVD2)*; IC13 1(RSVD1)* 10(RSVD2)*; IC14 1(RSVD1)* 10(RSVD2)*; IC15 1(RSVD1)* 10(RSVD2)*

### Buses and harness runs
harness EXTx1_a = port EXTx1_a
harness EXTx1_b = port EXTx1_b
harness EXTx1_c = port EXTx1_c
harness EXTx2_a = port EXTx2_a
harness EXTx2_b = port EXTx2_b
harness EXTx2_c = port EXTx2_c

### Notes on the sheet
- Project/Equipment
- Document
- Designer
- Drawn by
- Check.by
- Copyright WUT 2023.
  This document describes Open Hardware and is licensed under the CERN-OHL-W v2
  You may redistribute and modify this documentation and make products using it under the terms of the CERN-OHL-W v2 (https:/cern.ch/cern-ohl). This documentation is distributed WITHOUT ANY EXPRESS OR IMPLIED WARRANTY, INCLUDING OF MERCHANTABILITY, SATISFACTORY QUALITY AND FITNESS FOR A PARTICULAR PURPOSE. Please see the CERN-OHL-W v2 for applicable conditions.
  Source location: https://github.com/sinara-hw/EEM_FMC_Carrier
  As per CERN-OHL-W v2 section 4, should You produce hardware based on these sources, You must maintain the Source Location visible on the silkscreen or top copper for a EEM FMC Carrier PCB or other product you make using this documentation.
- Contact:
- File
- Last Mod.
- Print Date
- Sheet
- Size
- A3
- of
- Rev

### Library data of the parts
C41-C48 = CC0402_100NF_16V_10%_X7R: as C5 on sheet Clock_Distribution; Part Number: CC0402_100NF_16V_10%_X7R; Component Kind: Standard; Component Type: Standard; Pin Count: 2; Value: 100nF; Status: Not Recommended; Manufacturer Part Number: CC0402_100NF_16V_10%_X7R; Case: 0402; Mounted: Yes; Socket: No; SMD: Yes; Sense: No; HelpURL: \\cern.ch\dfs\Applications\Altium\Datasheets\CC0402_X7R_MURATA_GRM.pdf; Author: CERN DEM JLC; CreateDate: 05.12.2013; LatestRevisionDate: 03.12.2007; Manufacturer1 Example: MURATA; Manufacturer1 ComponentHeight: 0.55mm
IC8-IC15 = HD3SS3212RKS: Two-Channel Differential 2:1/1:2 USB3.1 Mux/Demux; Manufacturer: TEXAS INSTRUMENTS; PressFit: No; Bonding: No; Part Number: HD3SS3212RKS; Component Kind: Standard; Component Type: Standard; Device: HD3SS3212RKS; PackageDescription: QFN, TEXAS Case Style RKS, 0.50mm Pitch, Rect.; 20 Pin, 2.50mm L X 4.50mm W X 1.00mm H body (w/Thermal Tab 1.1mm X 3.1mm); Part Description: Two-Channel Differential 2:1/1:2 USB3.1 Mux/Demux; Manufacturer Part Number: HD3SS3212RKS; Pin Count: 21; Case: TQFN20; Mounted: Yes; Socket: No; SMD: Yes; Sense: No; ComponentHeight: 1mm; Author: CERN DEM BC; HelpURL: \\cern.ch\dfs\Applications\Altium\Datasheets\HD3SS3212RKS.pdf; CreateDate: 2019-11-06; LatestRevisionDate: 2019-11-06

## Sheet DIO_logic.SchDoc: DIOT_Kasli_Adapter
size 420 x 297 mm; CheckedBy: -; DrawnBy: Marcin Kiepiela; Address1: Warsaw University of Technology; Address2: Nowowiejska 15/19 00-665 Warsaw; DocumentNumber: 8; SheetNumber: 8; SheetTotal: 8; EDA_Number: ARTIQ; Projet: ARTIQ/Sinara/DIOT; ModifiedBy: -; CheckedDate: -; Title2: -; DivGrp: ISE; Designer: Marcin Kiepiela; ModifiedDate: -; ProjectName: DIOT_Kasli_Adapter.PrjPCB
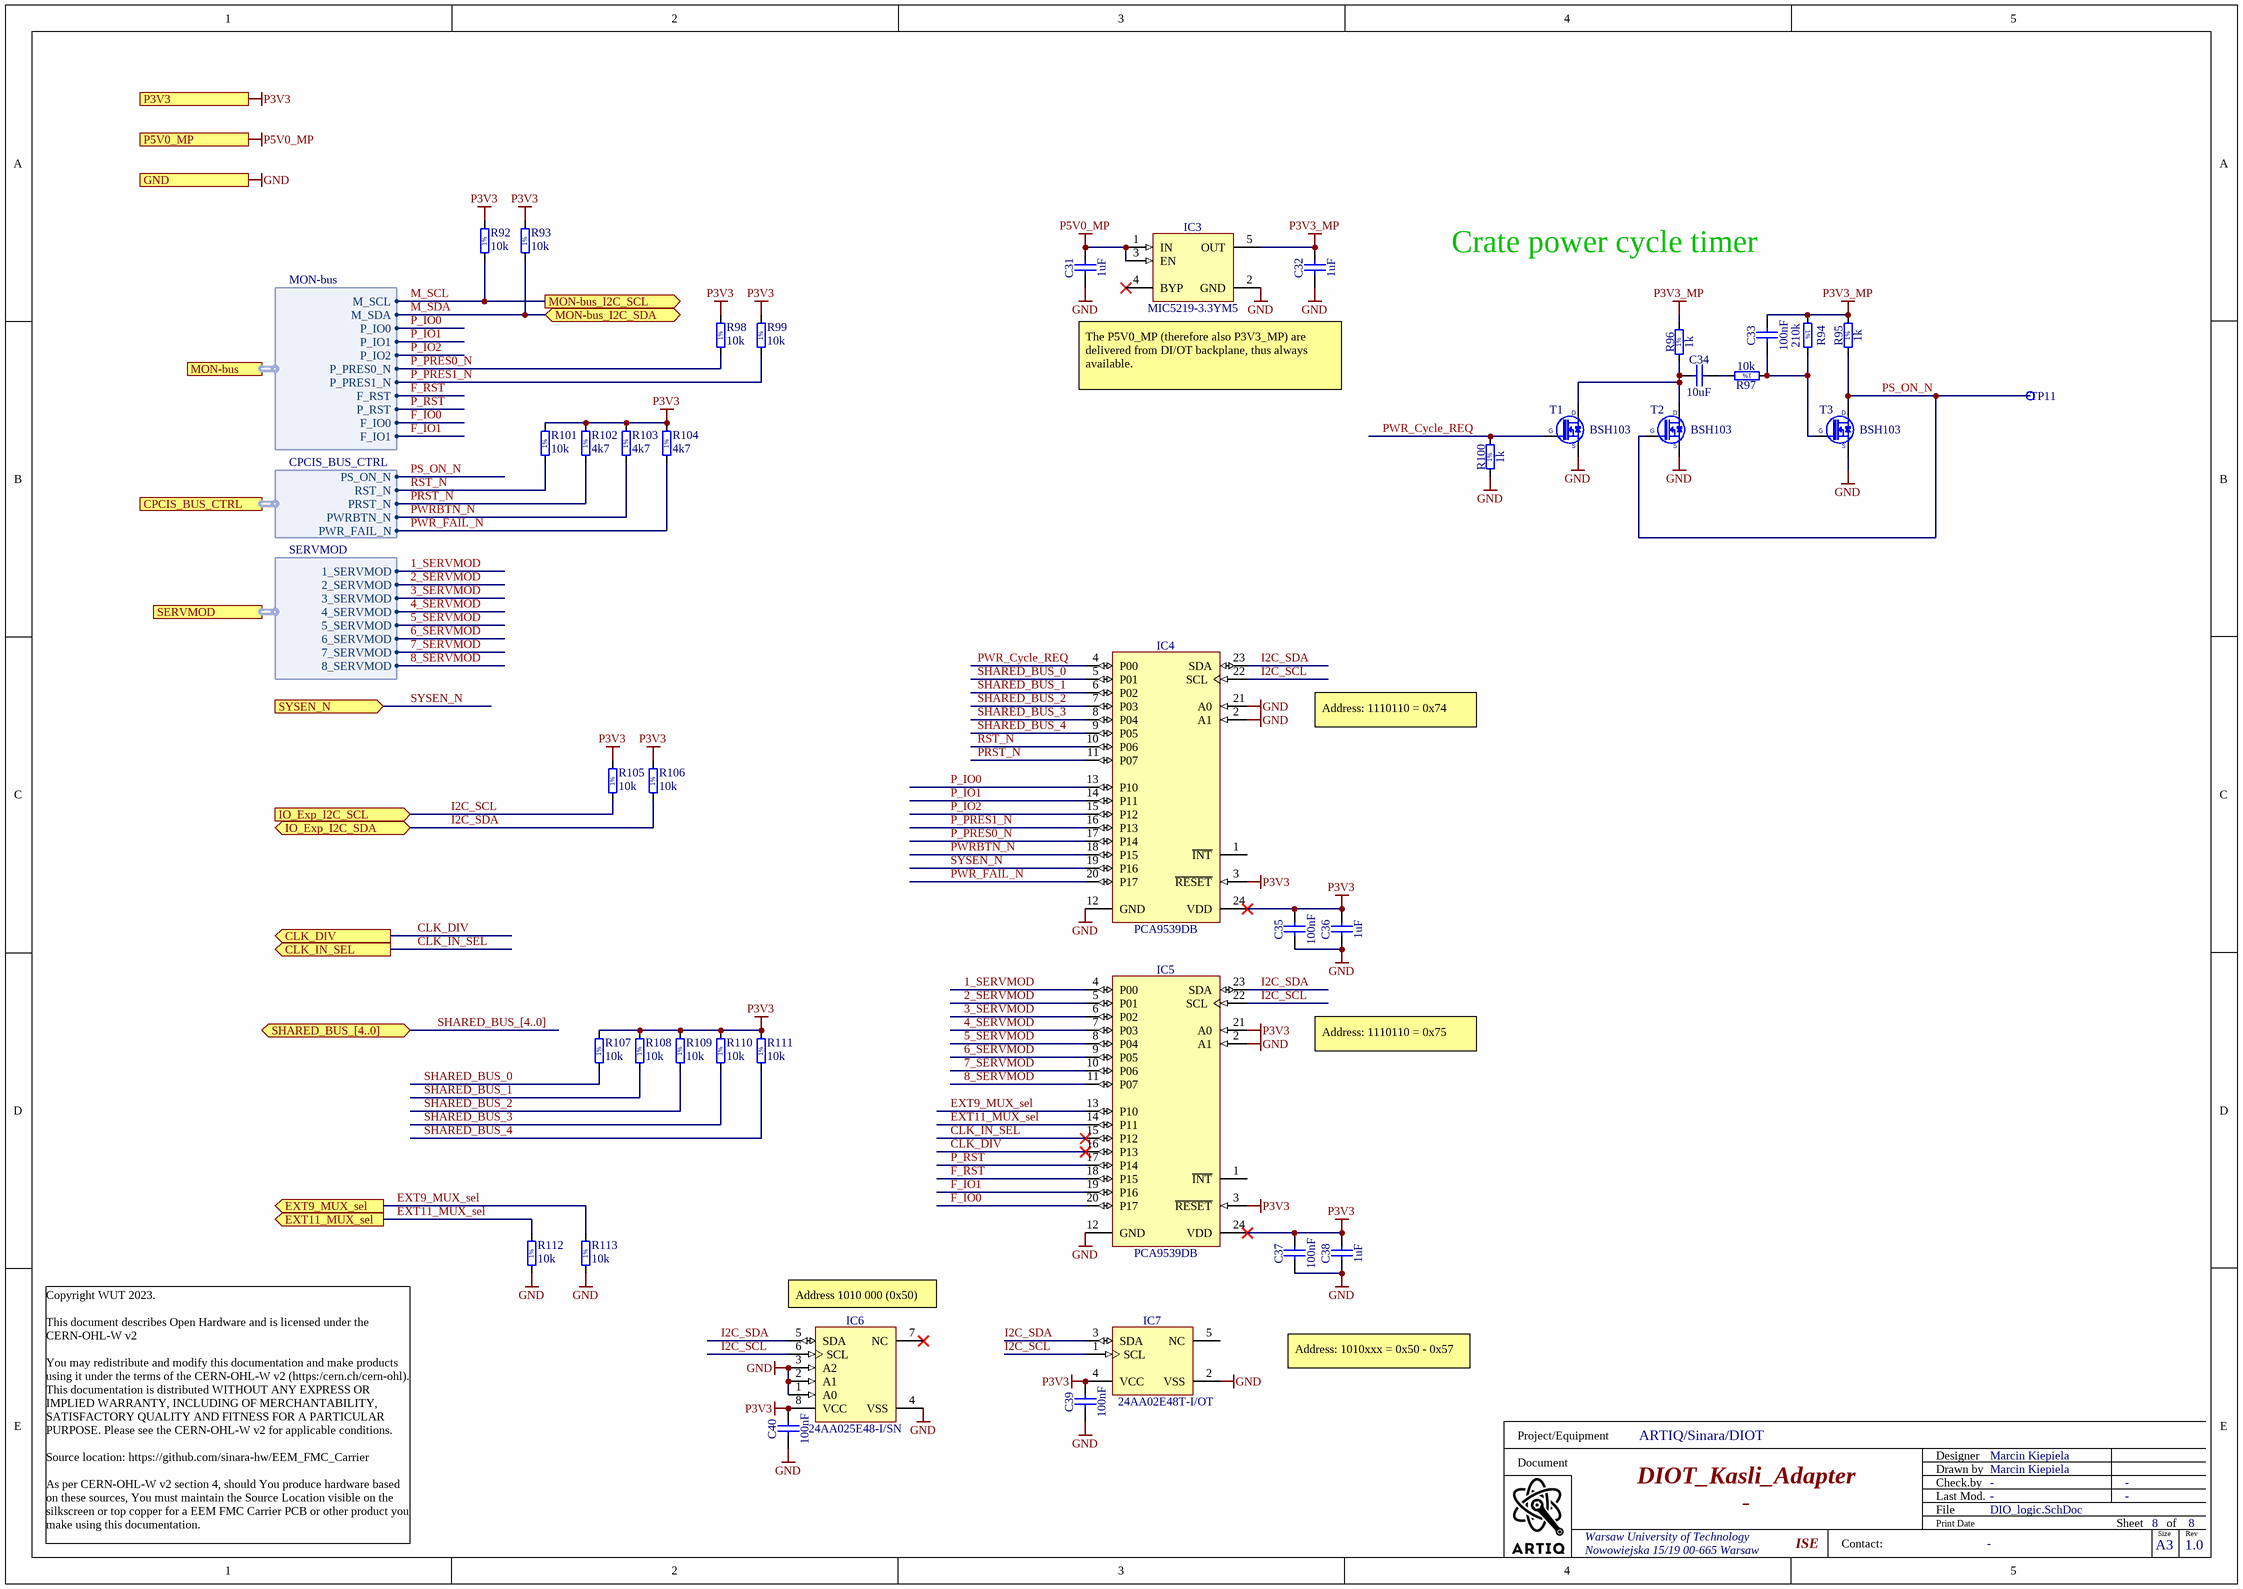
[diagram p7: DIO_logic.SchDoc]

### Parts
C31  1uF  [CAPC1608X87N]
C32  1uF  [CAPC1608X87N]
C33  100nF  [CAPC1005X55N]
C34  10uF  [CAPC1608X80N]
C35  100nF  [CAPC1005X55N]
C36  1uF  [CAPC1608X87N]
C37  100nF  [CAPC1005X55N]
C38  1uF  [CAPC1608X87N]
C39  100nF  [CAPC1005X55N]
C40  100nF  [CAPC1005X55N]
IC3  MIC5219-3.3YM5  [SOT95P280X145-5N]
IC4  PCA9539DB  [SOP65P780X200-24N]
IC5  PCA9539DB  [SOP65P780X200-24N]
IC6  24AA025E48-I/SN  [SOIC127P600X175-8N]
IC7  24AA02E48T-I/OT  [SOT95P280X145-5N]
R92  10k  [RESC1005X40N]
R93  10k  [RESC1005X40N]
R94  210k  [RESC1005X40N]
R95  1k  [RESC1005X40N]
R96  1k  [RESC1005X40N]
R97  10k  [RESC1005X40N]
R98  10k  [RESC1005X40N]
R99  10k  [RESC1005X40N]
R100  1k  [RESC1005X40N]
R101  10k  [RESC1005X40N]
R102  4k7  [RESC1005X40N]
R103  4k7  [RESC1005X40N]
R104  4k7  [RESC1005X40N]
R105  10k  [RESC1005X40N]
R106  10k  [RESC1005X40N]
R107  10k  [RESC1005X40N]
R108  10k  [RESC1005X40N]
R109  10k  [RESC1005X40N]
R110  10k  [RESC1005X40N]
R111  10k  [RESC1005X40N]
R112  10k  [RESC1005X40N]
R113  10k  [RESC1005X40N]
T1  BSH103  [SOT95P230X110-3N]
T2  BSH103  [SOT95P230X110-3N]
T3  BSH103  [SOT95P230X110-3N]
TP11  P3V3  [TPS127]  (value not drawn)  (no BOM)

### Ports
CLK_DIV (out), CLK_IN_SEL (out), CPCIS_BUS_CTRL (harness CPCIS_BUS_CTRL), EXT9_MUX_sel (out), EXT11_MUX_sel (out), GND, IO_Exp_I2C_SCL (in), IO_Exp_I2C_SDA (bidir), MON-bus (harness MON-bus), MON-bus_I2C_SCL (out), MON-bus_I2C_SDA (bidir), P3V3 (in), P5V0_MP (in), SERVMOD (harness SERVMOD), SHARED_BUS_[4..0] (bidir), SYSEN_N (in)

### Harnesses
CPCIS_BUS_CTRL: PS_ON_N, RST_N, PRST_N, PWRBTN_N, PWR_FAIL_N
MON-bus: M_SCL, M_SDA, P_IO0, P_IO1, P_IO2, P_PRES0_N, P_PRES1_N, F_RST, P_RST, F_IO0, F_IO1
SERVMOD: 5_SERVMOD, 6_SERVMOD, 2_SERVMOD, 7_SERVMOD, 3_SERVMOD, 4_SERVMOD, 1_SERVMOD, 8_SERVMOD

### Nets
GND: C31.1 C32.1 C35.1 C36.1 C37.1 C38.1 C39.1 C40.1 IC3.2(GND) IC4.2(A1) IC4.12(GND) IC4.21(A0) IC5.2(A1) IC5.12(GND) IC6.1(A0) IC6.2(A1) IC6.3(A2) IC6.4(VSS) IC7.2(VSS) R100.1 R112.1 R113.1 T1.2(S) T2.2(S) T3.2(S) ; port GND
P3V3: C35.2 C36.2 C37.2 C38.2 C39.2 C40.2 IC4.3(~{RESET}) IC4.24(VDD) IC5.3(~{RESET}) IC5.21(A0) IC5.24(VDD) IC6.8(VCC) IC7.4(VCC) R92.2 R93.2 R98.2 R99.2 R101.2 R102.2 R103.2 R104.2 R105.2 R106.2 R107.2 R108.2 R109.2 R110.2 R111.2 ; port P3V3
P3V3_MP: C32.2 C33.2 IC3.5(OUT) R94.1 R95.2 R96.2
P5V0_MP: C31.2 IC3.1(IN) IC3.3(EN) ; port P5V0_MP
1_SERVMOD: IC5.4(P00) ; port SERVMOD.1_SERVMOD  [project net SERVMOD.1_SERVMOD]
2_SERVMOD: IC5.5(P01) ; port SERVMOD.2_SERVMOD  [project net SERVMOD.2_SERVMOD]
3_SERVMOD: IC5.6(P02) ; port SERVMOD.3_SERVMOD  [project net SERVMOD.3_SERVMOD]
4_SERVMOD: IC5.7(P03) ; port SERVMOD.4_SERVMOD  [project net SERVMOD.4_SERVMOD]
5_SERVMOD: IC5.8(P04) ; port SERVMOD.5_SERVMOD  [project net SERVMOD.5_SERVMOD]
6_SERVMOD: IC5.9(P05) ; port SERVMOD.6_SERVMOD  [project net SERVMOD.6_SERVMOD]
7_SERVMOD: IC5.10(P06) ; port SERVMOD.7_SERVMOD  [project net SERVMOD.7_SERVMOD]
8_SERVMOD: IC5.11(P07) ; port SERVMOD.8_SERVMOD  [project net SERVMOD.8_SERVMOD]
CLK_DIV: IC5.16(P13) ; port CLK_DIV
CLK_IN_SEL: IC5.15(P12) ; port CLK_IN_SEL
EXT9_MUX_sel: IC5.13(P10) R113.2 ; port EXT9_MUX_sel
EXT11_MUX_sel: IC5.14(P11) R112.2 ; port EXT11_MUX_sel
F_IO0: IC5.20(P17) ; port MON-bus.F_IO0
F_IO1: IC5.19(P16) ; port MON-bus.F_IO1
F_RST: IC5.18(P15) ; port MON-bus.F_RST
I2C_SCL: IC4.22(SCL) IC5.22(SCL) IC6.6(SCL) IC7.1(SCL) R105.1 ; port IO_Exp_I2C_SCL  [project net I2C_SCL_11]
I2C_SDA: IC4.23(SDA) IC5.23(SDA) IC6.5(SDA) IC7.3(SDA) R106.1 ; port IO_Exp_I2C_SDA  [project net I2C_SDA_11]
M_SCL: R92.1 ; port MON-bus_I2C_SCL, port MON-bus.M_SCL  [project net I2C_SCL_8]
M_SDA: R93.1 ; port MON-bus_I2C_SDA, port MON-bus.M_SDA  [project net I2C_SDA_8]
P_IO0: IC4.13(P10) ; port MON-bus.P_IO0
P_IO1: IC4.14(P11) ; port MON-bus.P_IO1
P_IO2: IC4.15(P12) ; port MON-bus.P_IO2
P_PRES0_N: IC4.17(P14) R98.1 ; port MON-bus.P_PRES0_N
P_PRES1_N: IC4.16(P13) R99.1 ; port MON-bus.P_PRES1_N
P_RST: IC5.17(P14) ; port MON-bus.P_RST
PRST_N: IC4.11(P07) R102.1 ; port CPCIS_BUS_CTRL.PRST_N
PS_ON_N: R95.1 T2.1(G) T3.3(D) TP11.1 ; port CPCIS_BUS_CTRL.PS_ON_N
PWR_Cycle_REQ: IC4.4(P00) R100.2 T1.1(G)  [project net PWR_Cycle_REQ_8]
PWR_FAIL_N: IC4.20(P17) R104.1 ; port CPCIS_BUS_CTRL.PWR_FAIL_N
PWRBTN_N: IC4.18(P15) R103.1 ; port CPCIS_BUS_CTRL.PWRBTN_N
RST_N: IC4.10(P06) R101.1 ; port CPCIS_BUS_CTRL.RST_N
SHARED_BUS_0: IC4.5(P01) R107.1  [project net SHARED_BUS_0_1]
SHARED_BUS_1: IC4.6(P02) R108.1  [project net SHARED_BUS_1_1]
SHARED_BUS_2: IC4.7(P03) R109.1  [project net SHARED_BUS_2_1]
SHARED_BUS_3: IC4.8(P04) R110.1  [project net SHARED_BUS_3_1]
SHARED_BUS_4: IC4.9(P05) R111.1  [project net SHARED_BUS_4_1]
SYSEN_N: IC4.19(P16) ; port SYSEN_N
NetC33_1: C33.1 R94.2 R97.1 T3.1(G)
NetC34_1: C34.1 R96.1 T1.3(D) T2.3(D)
NetC34_2: C34.2 R97.2

Not connected (* = marked no-connect by the designer): IC3 4(BYP)*; IC4 1(~{INT}); IC5 1(~{INT}); IC6 7(NC)*; IC7 5(NC)

### Buses and harness runs
bus SHARED_BUS_[4..0] = port SHARED_BUS_[4..0]

### Notes on the sheet
- Crate power cycle timer
- The P5V0_MP (therefore also P3V3_MP) are delivered from DI/OT backplane, thus always available.
- Address: 1110110 = 0x74
- Address: 1110110 = 0x75
- (near IC6) Address 1010 000 (0x50)
- Address: 1010xxx = 0x50 - 0x57
- Project/Equipment
- Document
- Designer
- Drawn by
- Check.by
- Copyright WUT 2023.
  This document describes Open Hardware and is licensed under the CERN-OHL-W v2
  You may redistribute and modify this documentation and make products using it under the terms of the CERN-OHL-W v2 (https:/cern.ch/cern-ohl). This documentation is distributed WITHOUT ANY EXPRESS OR IMPLIED WARRANTY, INCLUDING OF MERCHANTABILITY, SATISFACTORY QUALITY AND FITNESS FOR A PARTICULAR PURPOSE. Please see the CERN-OHL-W v2 for applicable conditions.
  Source location: https://github.com/sinara-hw/EEM_FMC_Carrier
  As per CERN-OHL-W v2 section 4, should You produce hardware based on these sources, You must maintain the Source Location visible on the silkscreen or top copper for a EEM FMC Carrier PCB or other product you make using this documentation.
- Contact:
- File
- Last Mod.
- Print Date
- Sheet
- Size
- A3
- of
- Rev
- (in symbol R0402_1K_1%_0.0625W_100PPM) 1%
- (in symbol R0402_4K7_1%_0.0625W_100PPM) 1%
- (in symbol R0402_10K_1%_0.0625W_100PPM) 1%
- (in symbol R0402_210R_1%_0.0625W_100PPM) 1%

### Library data of the parts
C31 C32 C36 C38 = CC0603_1UF_25V_10%_X7R: as C7 on sheet Clock_Distribution; Part Number: CC0603_1UF_25V_10%_X7R; Component Kind: Standard; Component Type: Standard; Pin Count: 2; Value: 1uF; Status: None; Manufacturer Part Number: CC0603_1UF_25V_10%_X7R; Case: 0603; Mounted: Yes; Socket: No; SMD: Yes; Sense: No; Manufacturer1 Example: MURATA; Manufacturer1 ComponentHeight: 0.9mm; HelpURL: \\cern.ch\dfs\Applications\Altium\Datasheets\CC0603_X7R_MURATA.pdf; Author: CERN DEM JLC; CreateDate: 18.01.2011; LatestRevisionDate: 18.01.2011
C33 C35 C37 C39 C40 = CC0402_100NF_16V_10%_X7R: as C5 on sheet Clock_Distribution; Part Number: CC0402_100NF_16V_10%_X7R; Component Kind: Standard; Component Type: Standard; Pin Count: 2; Value: 100nF; Status: Not Recommended; Manufacturer Part Number: CC0402_100NF_16V_10%_X7R; Case: 0402; Mounted: Yes; Socket: No; SMD: Yes; Sense: No; HelpURL: \\cern.ch\dfs\Applications\Altium\Datasheets\CC0402_X7R_MURATA_GRM.pdf; Author: CERN DEM JLC; CreateDate: 05.12.2013; LatestRevisionDate: 03.12.2007; Manufacturer1 Example: MURATA; Manufacturer1 ComponentHeight: 0.55mm
C34 = CC0603_10UF_10V_10%_X5R: as C6 on sheet Clock_Distribution; Part Number: CC0603_10UF_10V_10%_X5R; Component Kind: Standard; Component Type: Standard; Pin Count: 2; Value: 10uF; Status: None; Manufacturer Part Number: CC0603_10UF_10V_10%_X5R; Case: 0603; Mounted: Yes; Socket: No; SMD: Yes; Sense: No; Manufacturer1 Example: MURATA; Manufacturer1 ComponentHeight: 0.8mm; HelpURL: \\cern.ch\dfs\Applications\Altium\Datasheets\CC0603_MURATA_GRM188R61A106KE69D.pdf; Author: CERN DEM JLC; CreateDate: 31.01.2017; LatestRevisionDate: 31.01.2017
IC3 = MIC5219-3.3YM5: 500mA Peak Output LDO Regulator; Part Description: 3.3V 500mA Peak Output Low Drop-Out  (LDO) Regulator; Manufacturer: MICROCHIP TECHNOLOGY; PressFit: No; Bonding: No; Part Number: MIC5219-3.3YM5; Component Kind: Standard; Component Type: Standard; Device: MIC5219-3.3YM5; PackageDescription: SOT, 0.95mm pitch; 5 pin, 1.60mm W X 2.90mm L X 1.45mm H body, IPC Medium Density; Manufacturer Part Number: MIC5219-3.3YM5; Pin Count: 5; Case: SOT23-5; Mounted: Yes; Socket: No; SMD: Yes; Sense: No; ComponentHeight: 1.45mm; HelpURL: \\cern.ch\dfs\Applications\Altium\Datasheets\MIC5219-3.3YM5.pdf; Author: CERN DEM WB; CreateDate: 2019-04-16; LatestRevisionDate: 2019-04-16
IC4 IC5 = PCA9539DB: Remote 16-Bit I2C and SMBus Low-Power I/O Expander With Interrupt Output, Reset, and Configuration Registers; Manufacturer: TEXAS INSTRUMENTS; PressFit: No; Bonding: No; Part Number: PCA9539DB; Component Kind: Standard; Component Type: Standard; Device: PCA9539DB; PackageDescription: SOP, 0.65mm Pitch; 24 pin, 5.30mm W X 8.20mm L X 2.00mm H body, IPC Medium Density; Part Description: Remote 16-Bit I2C and SMBus Low-Power I/O Expander with Interrupt Output, Reset, and Configuration Registers; Manufacturer Part Number: PCA9539DB; Pin Count: 24; Case: TSSOP24; Mounted: Yes; Socket: No; SMD: Yes; Sense: No; ComponentHeight: 2mm; Author: CERN DEM HF; HelpURL: \\cern.ch\dfs\Applications\Altium\Datasheets\PCA9539DB.pdf; CreateDate: 09.06.2022; LatestRevisionDate: 09.06.2022
IC6 = 24AA025E48-I/SN: 1.7V-5.5V, 2K I2C™ Serial EEPROMs with EUI-48™ Node Identity; Manufacturer: MICROCHIP TECHNOLOGY; PressFit: No; Bonding: No; Part Number: 24AA025E48-I/SN; Component Kind: Standard; Component Type: Standard; Device: 24AA025E48-I/SN; PackageDescription: SOIC 8, Pitch 1.27mm - Body 4x5mm, IPC Medium Density; Part Description: 1.7V-5.5V, 2K I2C™ Serial EEPROMs with EUI-48™ Node Identity; Manufacturer Part Number: 24AA025E48-I/SN; Pin Count: 8; Case: SOIC8; Mounted: Yes; Socket: No; SMD: Yes; Sense: No; ComponentHeight: 1.75mm; HelpURL: \\cern.ch\dfs\Applications\Altium\Datasheets\24AA025E48-I-SN.pdf; Author: CERN DEM MR; CreateDate: 19.07.2016; LatestRevisionDate: 19.07.2016
IC7 = 24AA02E48T-I/OT: 1.7V-5.5V, 2K I2C Serial EEPROM With EUI-48 Node Identity; Manufacturer: MICROCHIP TECHNOLOGY; PressFit: No; Bonding: No; Part Number: 24AA02E48T-I/OT; Component Kind: Standard; Component Type: Standard; Device: 24AA02E48T-I/OT; PackageDescription: SOT, 0.95mm pitch; 5 pin, 1.60mm W X 2.90mm L X 1.45mm H body, IPC Medium Density; Part Description: 1.7V-5.5V, 2K I2C Serial EEPROM With EUI-48 Node Identity; Manufacturer Part Number: 24AA02E48T-I/OT; Pin Count: 5; Case: SOT23-5; Mounted: Yes; Socket: No; SMD: Yes; Sense: No; ComponentHeight: 1.45mm; HelpURL: \\cern.ch\dfs\Applications\Altium\Datasheets\24AA02E48T-I-OT.pdf; Author: CERN DEM MR; CreateDate: 31.03.2016; LatestRevisionDate: 31.03.2016
R92 R93 R98 R99 R101 R105-R113 = R0402_10K_1%_0.0625W_100PPM: as R1 on sheet Clock_Distribution; Part Number: R0402_10K_1%_0.0625W_100PPM; Component Kind: Standard; Component Type: Standard; Pin Count: 2; Value: 10k; Status: Not recommended; Power: 0.0625W; Tolerance: ±1%; Manufacturer Part Number: R0402_10K_1%_0.0625W_100PPM; Case: 0402; Mounted: Yes; Sense: No; Socket: No; SMD: Yes; Manufacturer1 Example: YAGEO PHYCOMP; Manufacturer1 ComponentHeight: 0.4mm; HelpURL: \\cern.ch\dfs\Applications\Altium\Datasheets\R0402_Phycomp_RC0402.pdf; Author: CERN DEM JLC; CreateDate: 03.12.2007; LatestRevisionDate: 17.10.2012
R94 = R0402_210R_1%_0.0625W_100PPM: Resistor - 1%; Part Number: R0402_210k_1%_0.0625W_100PPM; Part Description: General Purpose Thick Film Chip Resistor; Manufacturer: GENERIC; Manufacturer1 Part Number: CRCW0402240RFKED; TC: ±100ppm/°C; PressFit: No; Component Kind: Standard; Component Type: Standard; Pin Count: 2; Value: 210k; Status: None; Power: 0.0625W; Tolerance: ±1%; Manufacturer Part Number: R0402_210K_1%_0.0625W_100PPM; Case: 0402; Mounted: Yes; Sense: No; Socket: No; SMD: Yes; Manufacturer1 Example: VISHAY; Manufacturer1 ComponentHeight: 0.4mm; HelpURL: \\cern.ch\dfs\Applications\Altium\Datasheets\R0402_VISHAY_CRCW e3.pdf; Author: CERN DEM MR; CreateDate: 22-Nov-16; LatestRevisionDate: 22-Nov-16
R95 R96 R100 = R0402_1K_1%_0.0625W_100PPM: Resistor - 1%; Part Description: General Purpose Thick Film Chip Resistor; Manufacturer: GENERIC; Manufacturer1 Part Number: 232270671002L; TC: ±100ppm/°C; PressFit: No; Part Number: R0402_1K_1%_0.0625W_100PPM; Component Kind: Standard; Component Type: Standard; Pin Count: 2; Value: 1k; Status: Not Recommended; Power: 0.0625W; Tolerance: ±1%; Manufacturer Part Number: R0402_1K_1%_0.0625W_100PPM; Case: 0402; Mounted: Yes; Sense: No; Socket: No; SMD: Yes; Manufacturer1 Example: YAGEO PHYCOMP; Manufacturer1 ComponentHeight: 0.4mm; HelpURL: \\cern.ch\dfs\Applications\Altium\Datasheets\R0402_Phycomp_RC0402.pdf; Author: CERN DEM JLC; CreateDate: 03/12/2007; LatestRevisionDate: 17/10/2012
R97 = R0402_10K_1%_0.0625W_100PPM: Resistor - 1%; Part Description: General Purpose Thick Film Chip Resistor; Manufacturer: GENERIC; Manufacturer1 Part Number: 232270671003L; TC: ±100ppm/°C; PressFit: No; Part Number: R0402_10K_1%_0.0625W_100PPM; Component Kind: Standard; Component Type: Standard; Pin Count: 2; Value: 10k; Status: Not Recommended; Power: 0.0625W; Tolerance: ±1%; Manufacturer Part Number: R0402_10K_1%_0.0625W_100PPM; Case: 0402; Mounted: Yes; Sense: No; Socket: No; SMD: Yes; Manufacturer1 Example: YAGEO PHYCOMP; Manufacturer1 ComponentHeight: 0.4mm; HelpURL: \\cern.ch\dfs\Applications\Altium\Datasheets\R0402_Phycomp_RC0402.pdf; Author: CERN DEM JLC; CreateDate: 03-Dec-07; LatestRevisionDate: 17-Oct-12
R102-R104 = R0402_4K7_1%_0.0625W_100PPM: Resistor - 1%; Part Description: General Purpose Thick Film Chip Resistor; Manufacturer: GENERIC; Manufacturer1 Part Number: 232270674702L; TC: ±100ppm/°C; PressFit: No; Part Number: R0402_4K7_1%_0.0625W_100PPM; Component Kind: Standard; Component Type: Standard; Pin Count: 2; Value: 4k7; Status: Not Recommended; Power: 0.0625W; Tolerance: ±1%; Manufacturer Part Number: R0402_4K7_1%_0.0625W_100PPM; Case: 0402; Mounted: Yes; Sense: No; Socket: No; SMD: Yes; Manufacturer1 Example: YAGEO PHYCOMP; Manufacturer1 ComponentHeight: 0.4mm; HelpURL: \\cern.ch\dfs\Applications\Altium\Datasheets\R0402_Phycomp_RC0402.pdf; Author: CERN DEM JLC; CreateDate: 03-Dec-07; LatestRevisionDate: 17-Oct-12
T1-T3 = BSH103: N-CHANNEL MOSFET WITH DIODE; Part Description: 30V 850mA N-Channel Enhancement Mode Field-Effect Transistor; Manufacturer: NEXPERIA; PressFit: No; Bonding: No; Part Number: BSH103; Component Kind: Standard; Component Type: Standard; Device: BSH103; PackageDescription: SOT23, 3 pin, Pitch 0.95mm - 1.3mm W X 2.9mm L X 1.1mm H, IPC Medium Density; Manufacturer Part Number: BSH103; Pin Count: 3; Case: SOT23-3; Mounted: Yes; Socket: No; SMD: Yes; Sense: No; ComponentHeight: 1.1mm; HelpURL: \\cern.ch\dfs\Applications\Altium\Datasheets\BSH103.pdf; Author: CERN DEM JLC; CreateDate: 16.03.2010; LatestRevisionDate: 20.06.2017; ClassName: Artix
TP11 = SMD_PAD_1.27X1.27MM: Test Point; Part Description: 1.27mm x 1.27mm PCB Copper Area (SMD Test Point); Mounted: No; Part Number: SMD_PAD_1.27X1.27MM; Component Type: Standard (No BOM); Pin Count: 1; Family: Test Point; Socket: No; SMD: Yes; Sense: No; Status: None; ComponentHeight: 0mm; HelpURL: Undefined; Author: CERN DEM JLC; CreateDate: 12.01.2008; LatestRevisionDate: 12.01.2008; PackageDescription: 1.27mm x 1.27mm PCB Copper Area (SMD Test Point)